# EAGLE board Led_Beleuchtung (EAGLE 7.3.0), part 1 of 2
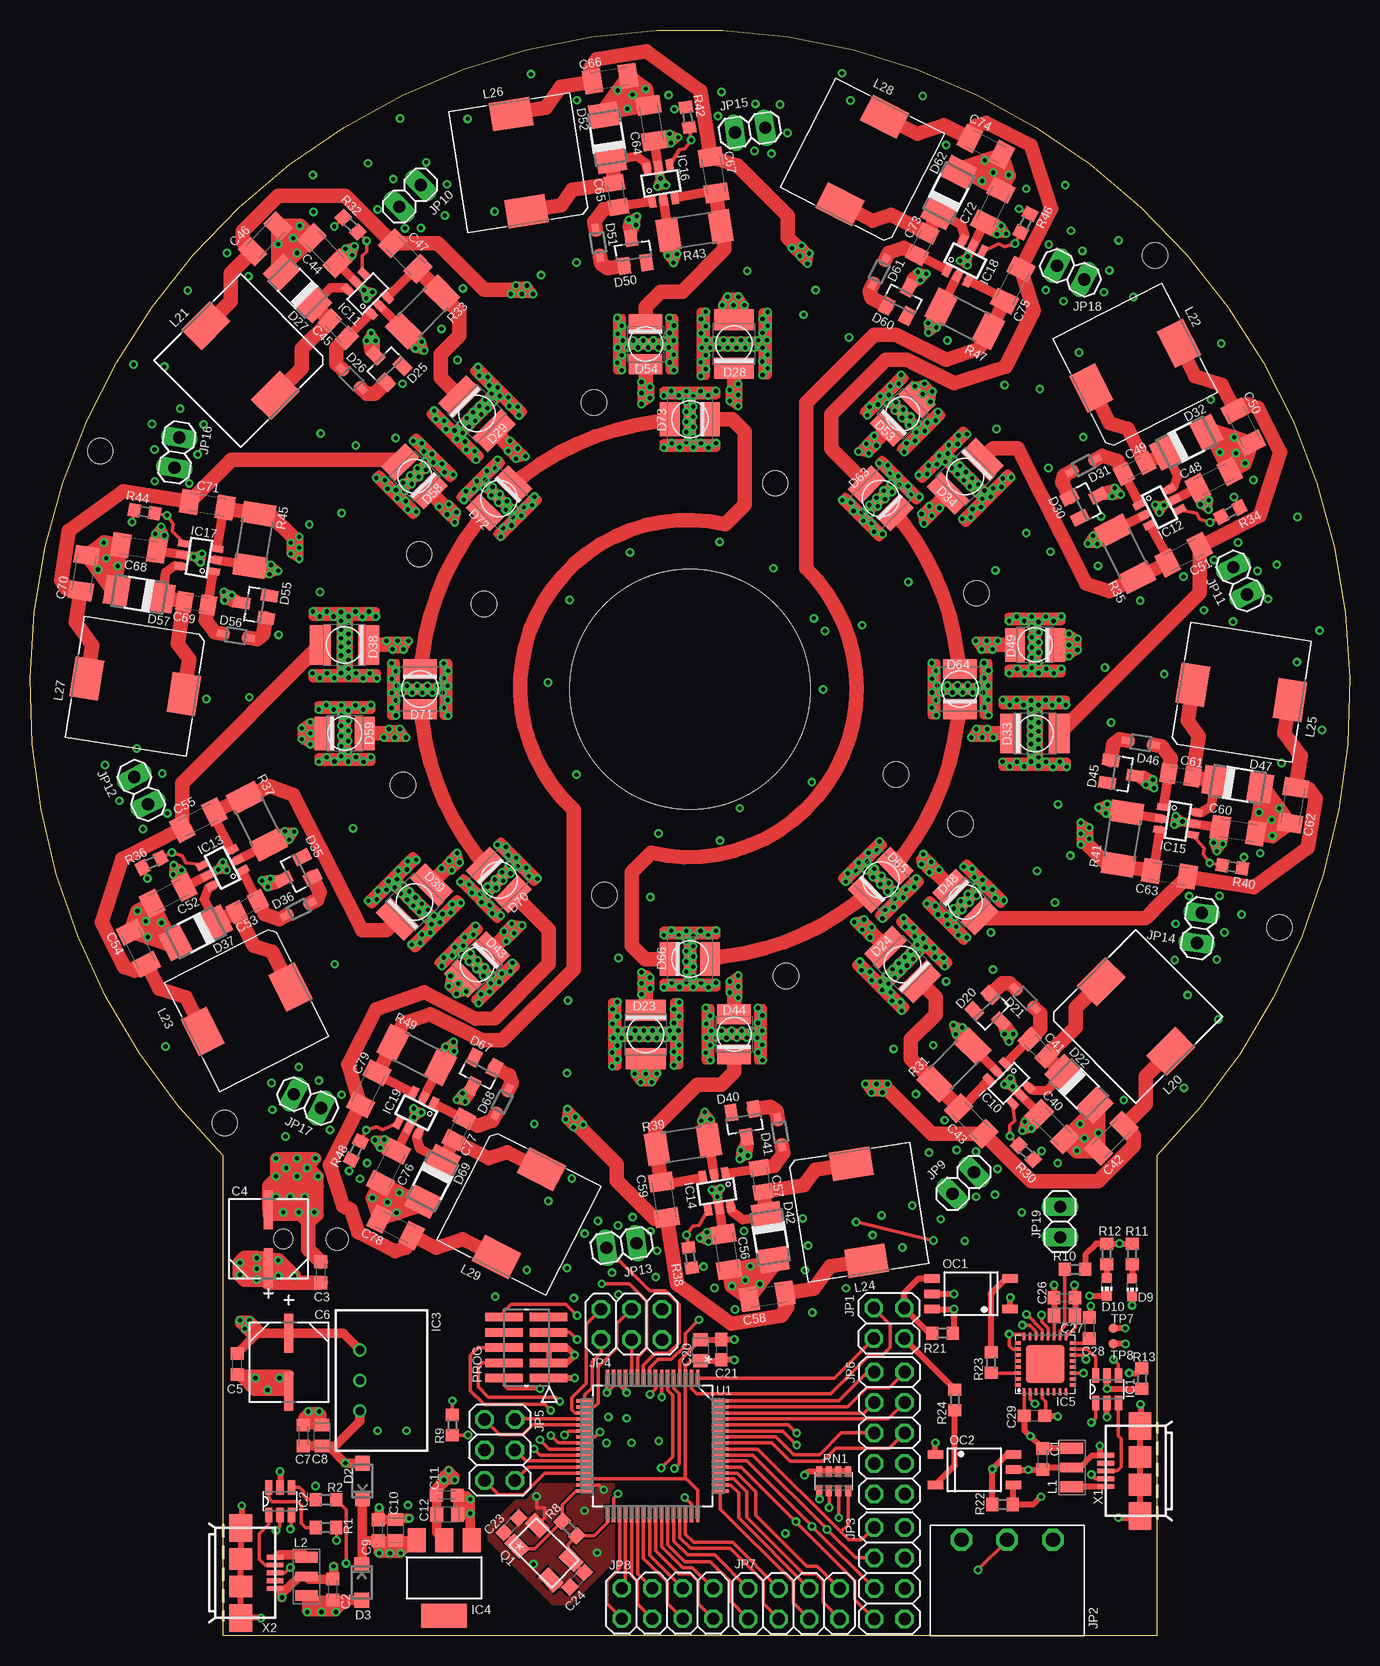
[diagram p3: board, top side]
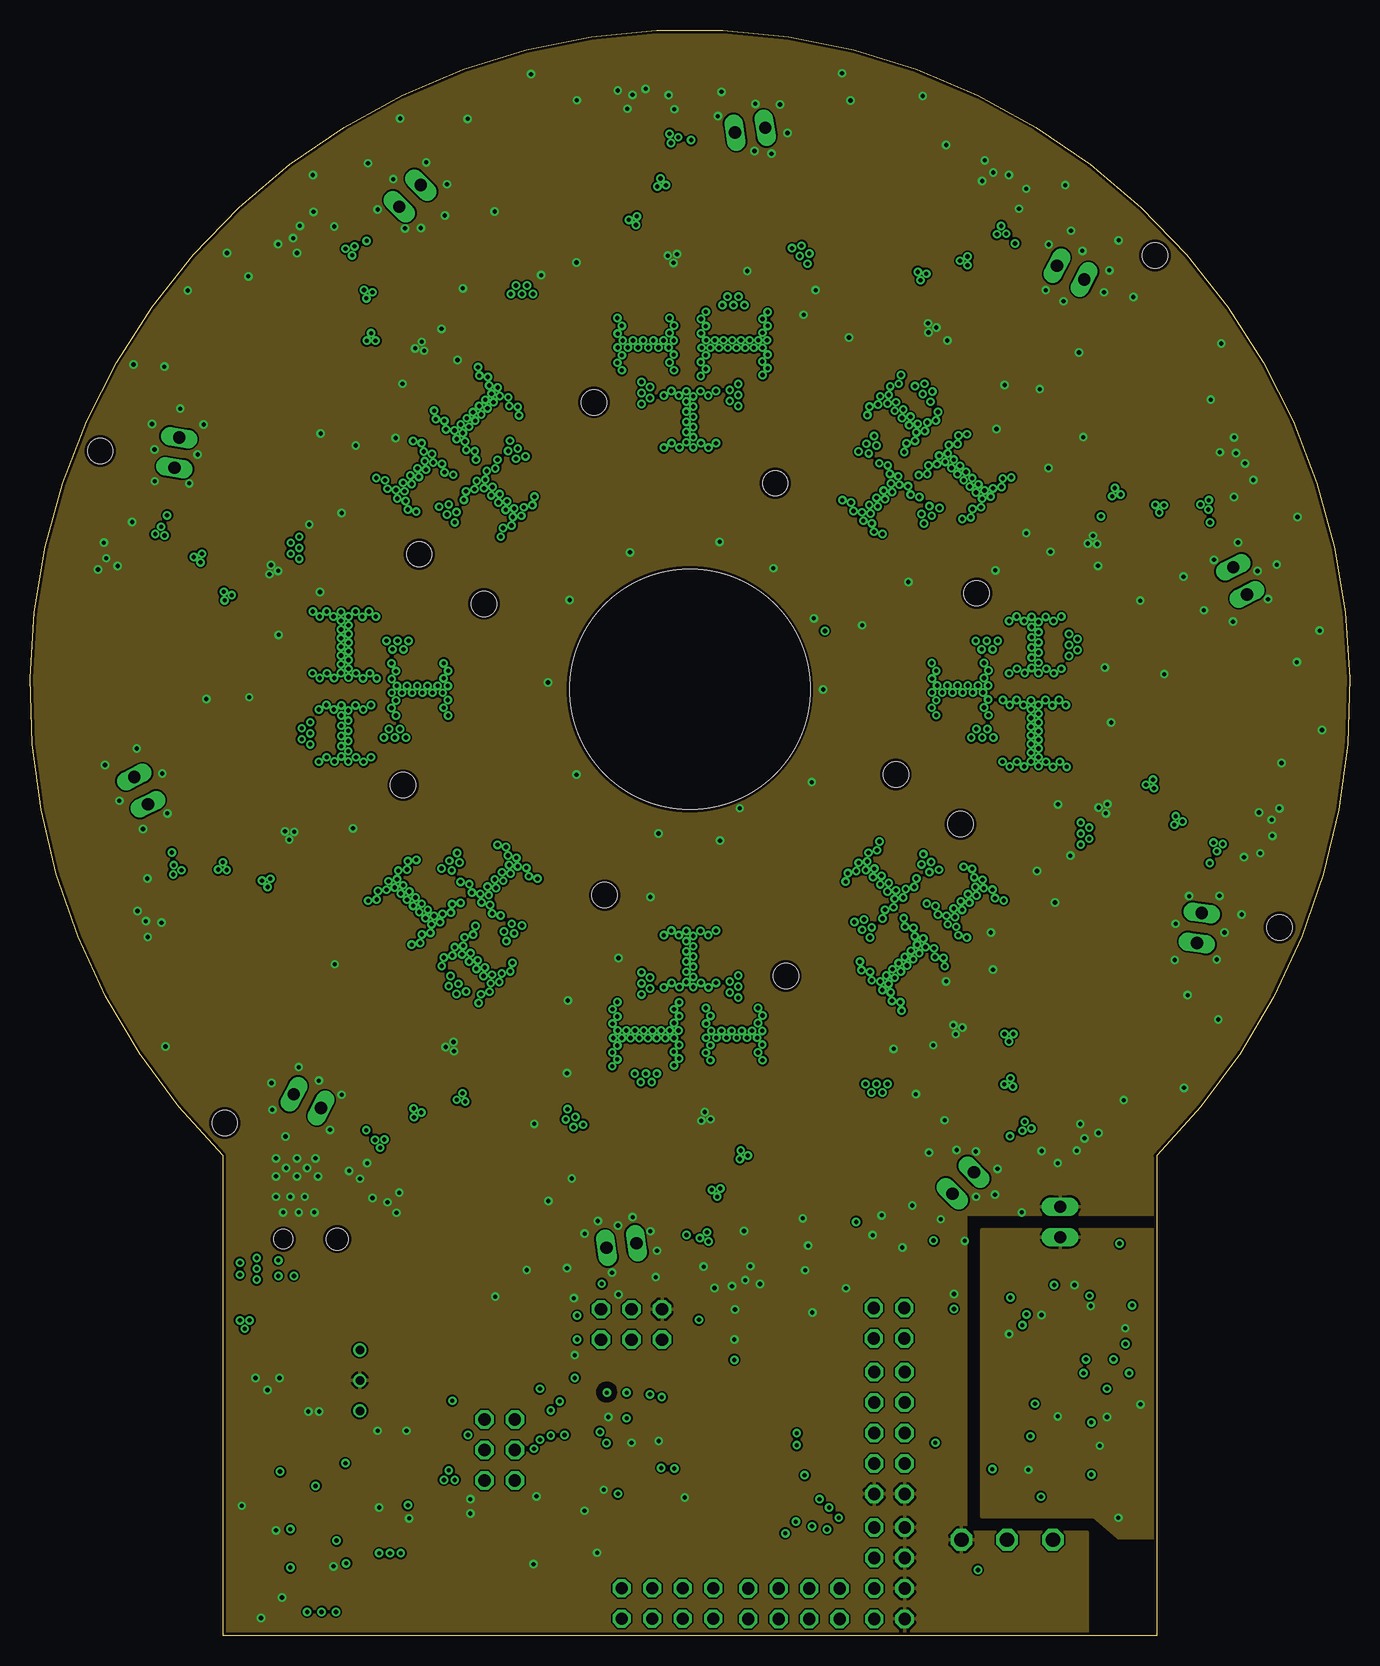
[diagram p4: board, inner layer Route2]
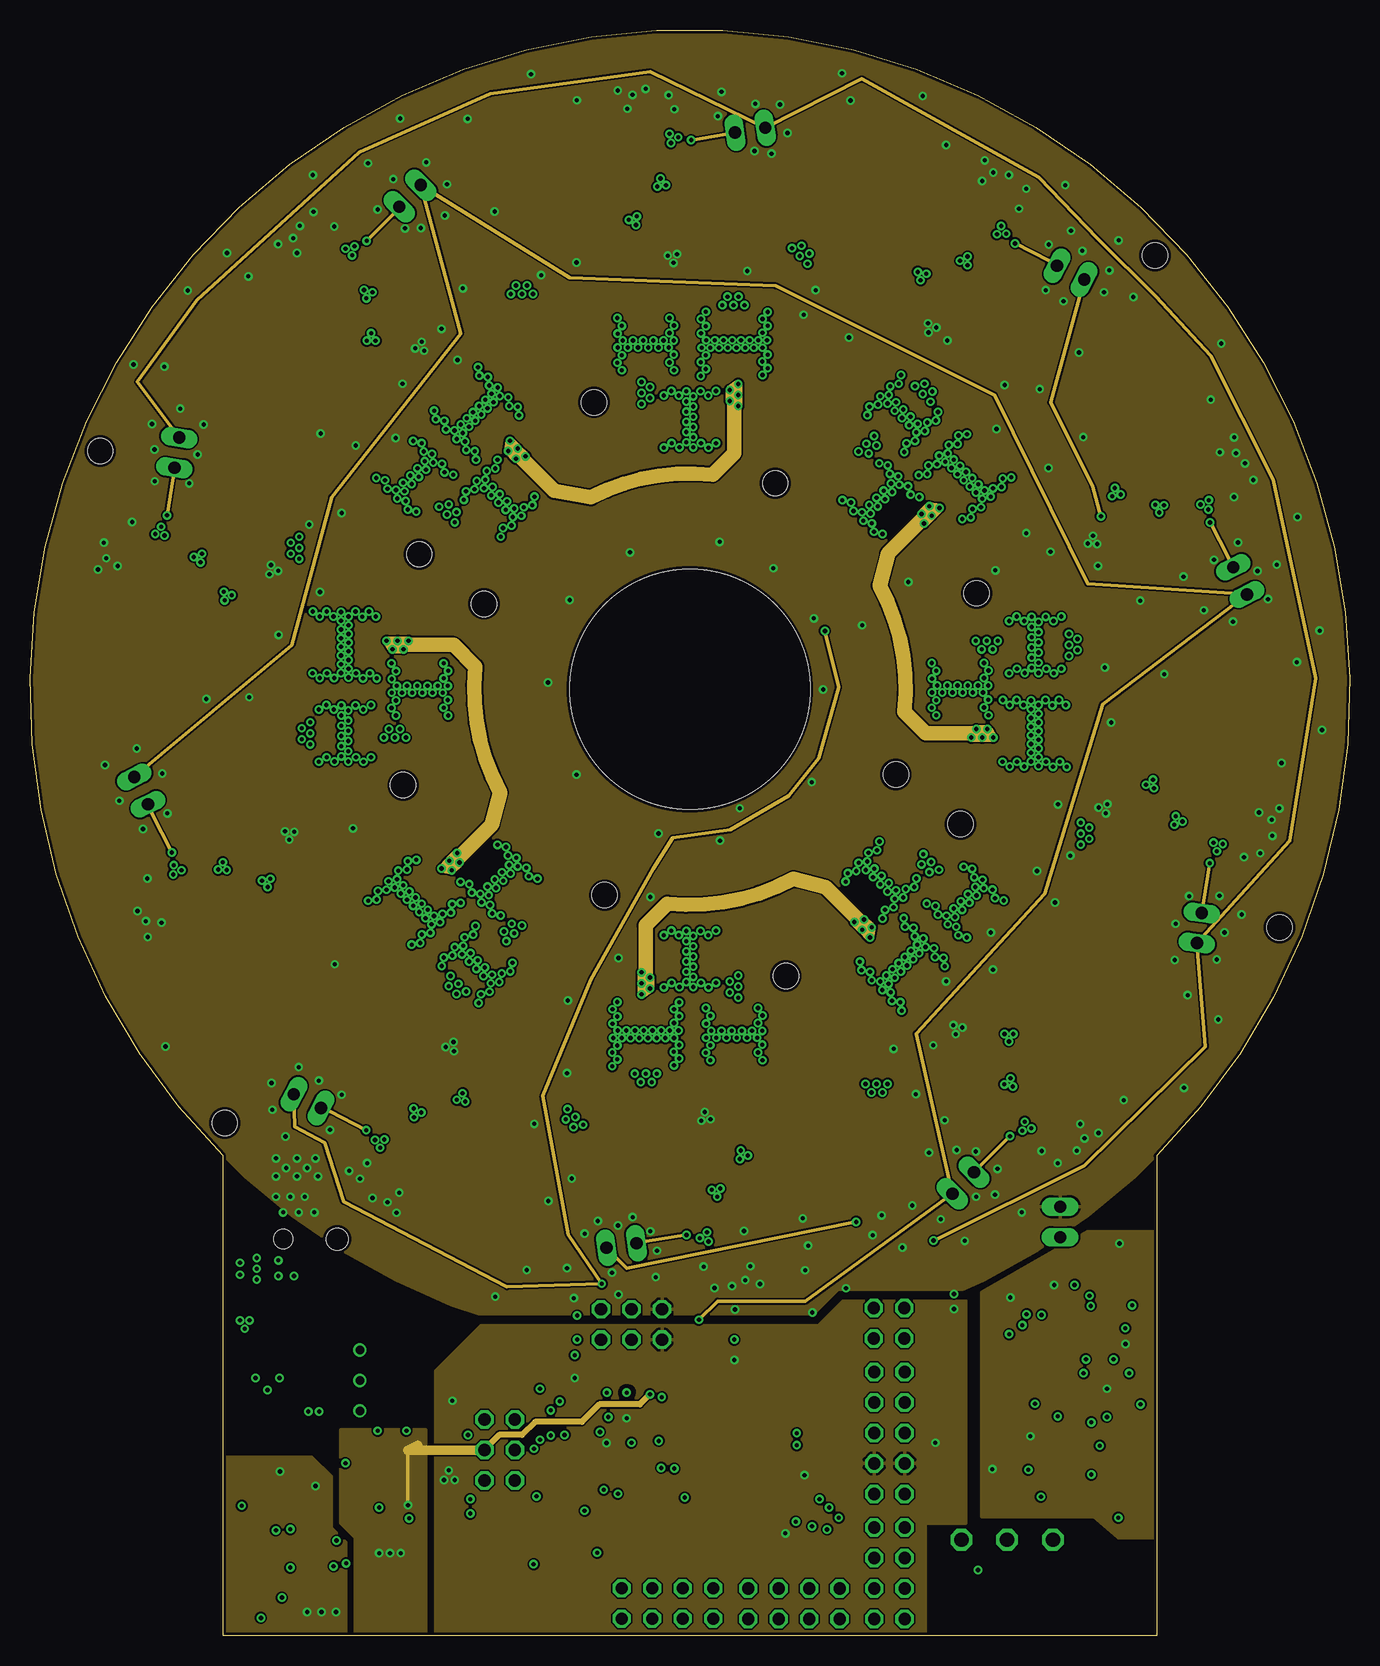
[diagram p5: board, inner layer Route3]
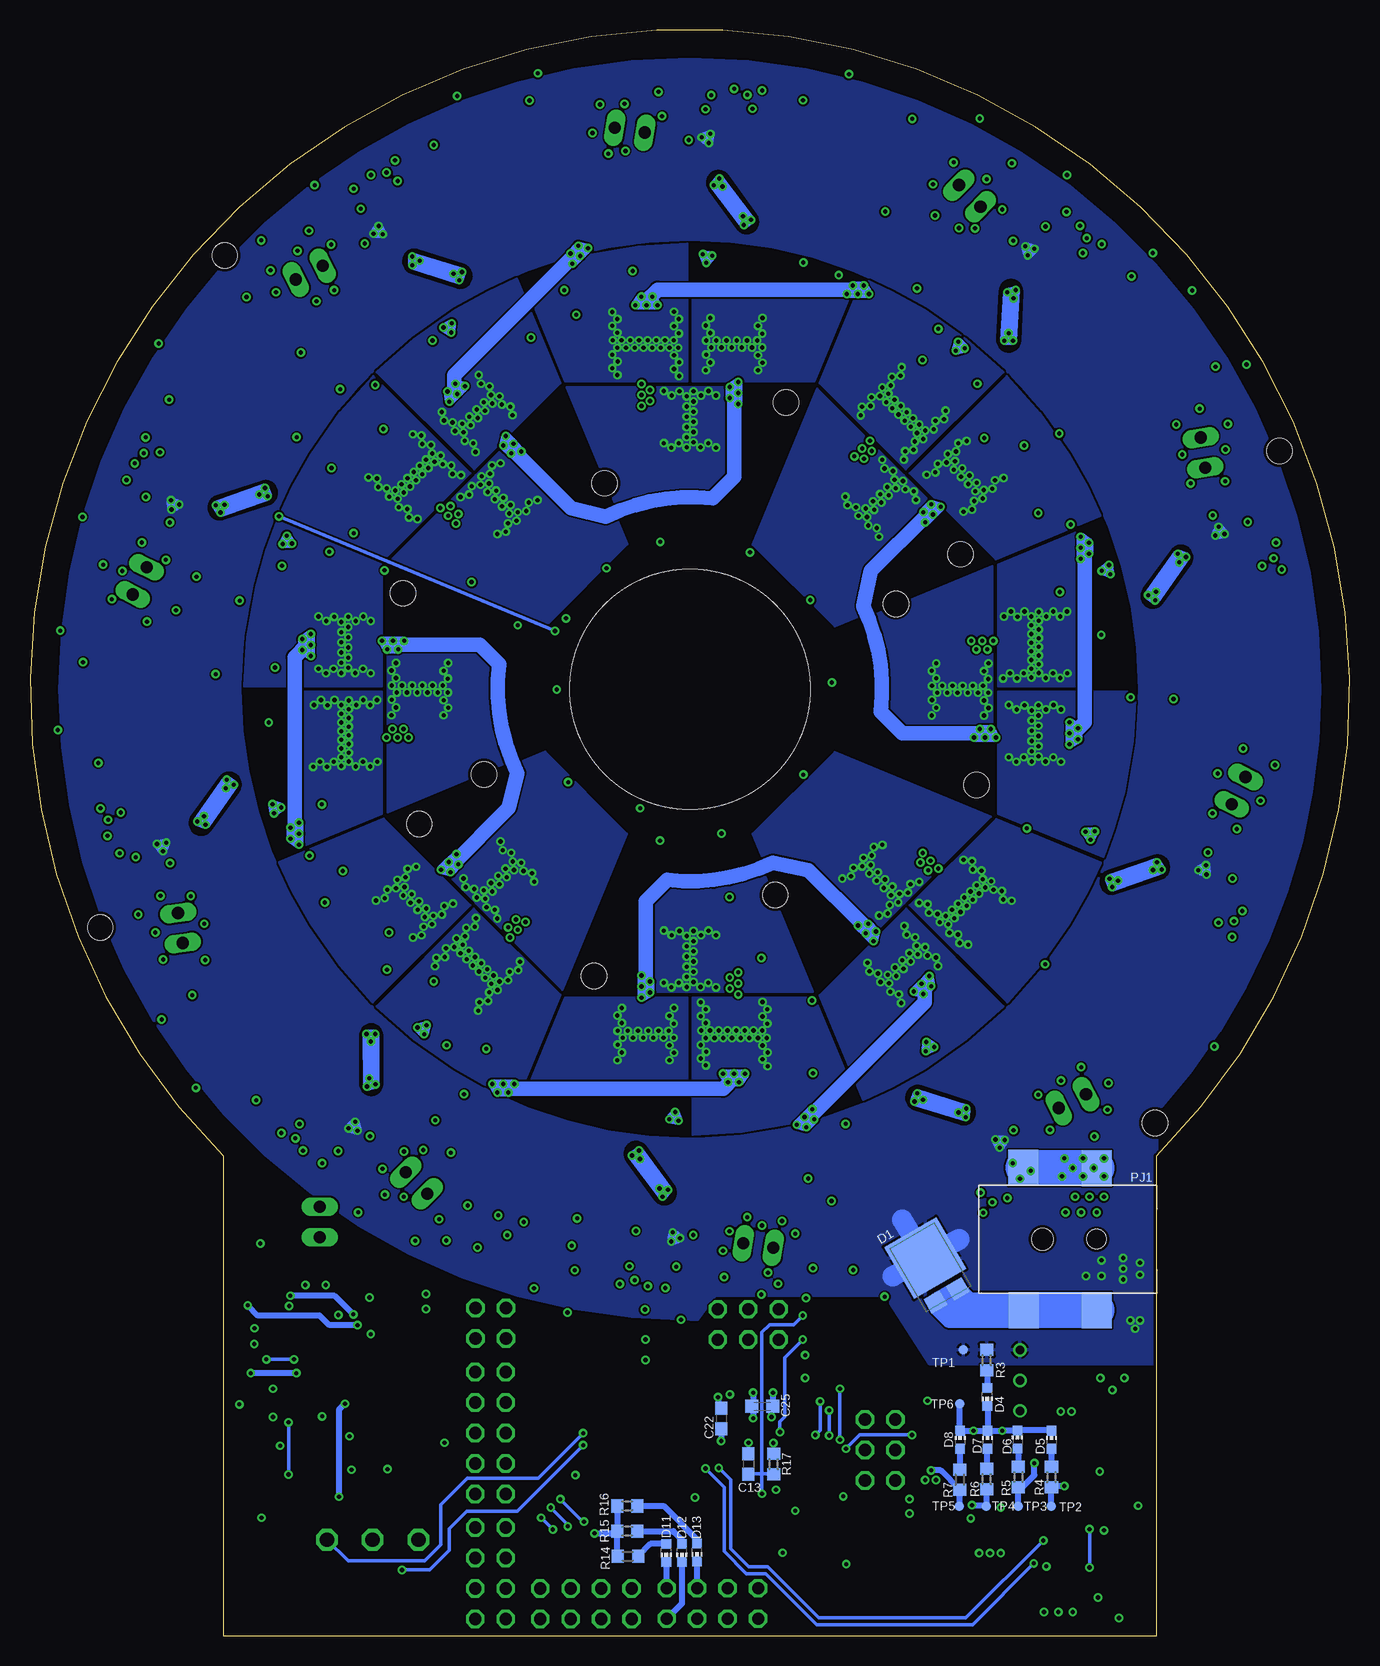
[diagram p6: board, bottom side, seen from below]

Size 109.98 x 133.82 mm. Coordinates in mm from the lower left corner, seen from the top.
Outline: 16.1,0 16.1,39.99 arc-270 93.88,39.99 93.88,0 16.1,0
Copper layers (1+2*3+16): Top 0.018mm / dielectric 0.36mm / Route2 0.035mm / dielectric 0.71mm / Route3 0.035mm / dielectric 0.36mm / Bottom 0.018mm
Design rules "eC_4Layer_PClass6_BaseCopperO18-I35_eCDefault *": minimum track width 0.15mm, minimum drill 0.35mm, track to track 0.15mm, track to pad 0.15mm, pad to pad 0.15mm, via to via 0.15mm, smd to smd 0mil, copper to edge 0.25mm, drill to drill 0.35mm, minimum pad ring 0.175mm, minimum via ring 0.125mm, stop-mask expansion 0mil, vias tented up to drill 0.45mm, thermal gap 0.2mm
Holes 2.1 mm at 62.1,96.05 37.83,85.99 47.88,61.72 72.15,71.78 32.44,90.13 47,102.78 78.89,86.88 77.54,67.64 62.99,54.99 31.09,70.89 5.85,98.74 93.75,115.03 104.13,59.03 16.23,42.74
Holes 20 mm at 54.99,78.88

## Footprints (pad centres in the part's own frame; a part is rotated, then mirrored left to right if it is on the bottom)
C0603K = smd 1.05 x 1.08: 1 -0.875,0; 2 0.875,0
CAPAE660X800N = smd 3.251 x 0.762: 1 -2.413,0; 2 2.413,0
CAPAE660X610N = smd 3.251 x 0.762: 1 -2.413,0; 2 2.413,0
SMC_P = smd 1.05 x 1.2: + -0.875,0; - 0.875,0
C0603 = smd 1.1 x 1: 1 -0.85,0; 2 0.85,0
C1206K = smd 1.5 x 2: 1 -1.5,0; 2 1.5,0
C0805K = smd 1.3 x 1.6: 1 -1,0; 2 1,0
TO-277A = smd 1.5 x 1.4: A1 1.065,-2.705; A2 -1.065,-2.705 | smd 5 x 5: C 0,0.895
SOD-123 = smd 1.25 x 1.22: A 1.475,0; C -1.475,0
CHIP-LED0603 = smd 0.8 x 0.8: A 0,-0.75; C 0,0.75
SOT23 = smd 1 x 1.4: 1 -0.95,-1.1; 2 0.95,-1.1; 3 0,1.1
SOD323 = smd 1 x 0.6: A 1.1,0; C -1.1,0
DO-214AC = smd 2 x 2.4: A 1.9,0; C -1.9,0
LTPL-C034UVH = smd 3.3 x 1.75: A 0,2.025; C 0,-2.025 | smd 1.27 x 0.635: TH 0,0
GW_CSSRM2.PM = smd 2.8 x 1.65: A 0,1.675; C 0,-1.675 | smd 1.27 x 0.635: TH 0,0
SFH_4715 = smd 2.8 x 1.65: A 0,1.675; C 0,-1.675 | smd 1.27 x 0.635: TH 0,0
SOT-23-6L = smd 0.6 x 1.2: 1 -0.95,-1.15; 2 0,-1.15; 3 0.95,-1.15; 4 0.95,1.15; 5 0,1.15; 6 -0.95,1.15
TSR-1 = drill 0.7 pad 1.1: 1 -2.54,0; 2 0,0; 3 2.54,0
SOT223 = smd 1.5 x 2: 1 -2.3,-3.15; 2 0,-3.15; 3 2.3,-3.15 | smd 3.8 x 2: 4 0,3.15
QFN32 = smd 0.6 x 0.3: 1 -2.3,1.75; 2 -2.3,1.25; 3 -2.3,0.75; 4 -2.3,0.25; 5 -2.3,-0.25; 6 -2.3,-0.75; 7 -2.3,-1.25; 8 -2.3,-1.75; 17 2.3,-1.75; 18 2.3,-1.25; 19 2.3,-0.75; 20 2.3,-0.25; 21 2.3,0.25; 22 2.3,0.75; 23 2.3,1.25; 24 2.3,1.75 | smd 0.3 x 0.6: 9 -1.75,-2.3; 10 -1.25,-2.3; 11 -0.75,-2.3; 12 -0.25,-2.3; 13 0.25,-2.3; 14 0.75,-2.3; 15 1.25,-2.3; 16 1.75,-2.3; 25 1.75,2.3; 26 1.25,2.3; 27 0.75,2.3; 28 0.25,2.3; 29 -0.25,2.3; 30 -0.75,2.3; 31 -1.25,2.3; 32 -1.75,2.3 | smd 3.2 x 3.2: EXP 0,0
DDC6_SOT = smd 0.6 x 1.1: 1 -0.95,-1.35; 2 0,-1.35; 3 0.95,-1.35; 4 0.95,1.35; 5 0,1.35; 6 -0.95,1.35
2X02 = drill 1.016 octagon: 1 -1.27,-1.27; 2 -1.27,1.27; 3 1.27,-1.27; 4 1.27,1.27
BCH-381H-3GN = drill 1.2 octagon: 1 3.81,8; 2 0,8; 3 -3.81,8
2X04 = drill 1.016 octagon: 1 -3.81,-1.27; 2 -3.81,1.27; 3 -1.27,-1.27; 4 -1.27,1.27; 5 1.27,-1.27; 6 1.27,1.27; 7 3.81,-1.27; 8 3.81,1.27
2X03 = drill 1.016 octagon: 1 -2.54,-1.27; 2 -2.54,1.27; 3 0,-1.27; 4 0,1.27; 5 2.54,-1.27; 6 2.54,1.27
2X05 = drill 1.016 octagon: 1 -5.08,-1.27; 2 -5.08,1.27; 3 -2.54,-1.27; 4 -2.54,1.27; 5 0,-1.27; 6 0,1.27; 7 2.54,-1.27; 8 2.54,1.27; 9 5.08,-1.27; 10 5.08,1.27
1X02 = drill 1.016 long: 1 -1.27,0; 2 1.27,0
EMIFILTER = smd 0.9 x 1.9: 1 -1.6,0; 3 1.6,0 | smd 0.8 x 1.9: 2 0,0
WE-PDF = smd 3.4 x 2.4: 1 0,4.1; 2 0,-4.1
PC400 = smd 0.7 x 1.3: 1 -1.27,-3.25; 3 1.27,-3.25; 4 1.27,3.25; 5 0,3.25; 6 -1.27,3.25
PJ-002AH-SMT-TR = smd 2.5 x 3: 1.1 5,5.915; 1.2 11.05,5.915; 2 5,-5.915; 3 11.1,-5.965 | hole 1.6: 5,0 | hole 1.8: 9.5,0
SAMTEC_FTS105-01-L-DV = smd 0.711 x 3.124: 1 -2.54,-1.854; 2 -2.54,1.854; 3 -1.27,-1.854; 4 -1.27,1.854; 5 0,-1.854; 6 0,1.854; 7 1.27,-1.854; 8 1.27,1.854; 9 2.54,-1.854; 10 2.54,1.854
ABM3B = smd 1.8 x 1.2: 1 -2,-1.2; 3 2,1.2; GND1 -2,1.2; GND2 2,-1.2
R0603 = smd 1 x 1.1: 1 -0.85,0; 2 0.85,0
R2010 = smd 1.8 x 2.7: 1 -2.2,0; 2 2.2,0
CTS742C083 = smd 0.5 x 0.9: 1 -1.2,-0.8; 2 -0.4,-0.8; 3 0.4,-0.8; 4 1.2,-0.8; 5 1.2,0.8; 6 0.4,0.8; 7 -0.4,0.8; 8 -1.2,0.8
TP08R = smd 0.8 x 0.8: TP 0,0
QFP50P1200X1200X160-64N = smd 1.422 x 0.279: 1 -5.639,3.759; 2 -5.639,3.251; 3 -5.639,2.743; 4 -5.639,2.261; 5 -5.639,1.753; 6 -5.639,1.245; 7 -5.639,0.762; 8 -5.639,0.254; 9 -5.639,-0.254; 10 -5.639,-0.762; 11 -5.639,-1.245; 12 -5.639,-1.753; 13 -5.639,-2.261; 14 -5.639,-2.743; 15 -5.639,-3.251; 16 -5.639,-3.759; 33 5.639,-3.759; 34 5.639,-3.251; 35 5.639,-2.743; 36 5.639,-2.261; 37 5.639,-1.753; 38 5.639,-1.245; 39 5.639,-0.762; 40 5.639,-0.254; 41 5.639,0.254; 42 5.639,0.762; 43 5.639,1.245; 44 5.639,1.753; 45 5.639,2.261; 46 5.639,2.743; 47 5.639,3.251; 48 5.639,3.759 | smd 0.279 x 1.422: 17 -3.759,-5.639; 18 -3.251,-5.639; 19 -2.743,-5.639; 20 -2.261,-5.639; 21 -1.753,-5.639; 22 -1.245,-5.639; 23 -0.762,-5.639; 24 -0.254,-5.639; 25 0.254,-5.639; 26 0.762,-5.639; 27 1.245,-5.639; 28 1.753,-5.639; 29 2.261,-5.639; 30 2.743,-5.639; 31 3.251,-5.639; 32 3.759,-5.639; 49 3.759,5.639; 50 3.251,5.639; 51 2.743,5.639; 52 2.261,5.639; 53 1.753,5.639; 54 1.245,5.639; 55 0.762,5.639; 56 0.254,5.639; 57 -0.254,5.639; 58 -0.762,5.639; 59 -1.245,5.639; 60 -1.753,5.639; 61 -2.261,5.639; 62 -2.743,5.639; 63 -3.251,5.639; 64 -3.759,5.639
MICRO-USB = smd 0.4 x 1.4: 1 -1.3,2.85; 2 -0.65,2.85; 3 0,2.85; 4 0.65,2.85; 5 1.3,2.85 | smd 2.3 x 1.9: GND1 -3.75,0; GND2 3.75,0 | smd 1.8 x 1.9: GND3 -1.15,0; GND4 1.15,0

## Placement (x,y rotation side)
C1  100nF  [C0603K]  84.38,14.73 90 top
C2  100nF  [C0603K]  25.23,3.85 270 top
C3  100nF  [C0603K]  24.23,30.29 270 top
C4  100UF  [CAPAE660X800N]  19.87,33.09 90 top
C5  100nF  [C0603K]  17.26,22.66 90 top
C6  22uF  [CAPAE660X610N]  21.58,22.79 270 top
C7  100nF  [C0603K]  22.78,16.68 270 top
C8  10uF  [SMC_P]  24.33,16.7 90 top
C9  100nF  [C0603K]  29.01,8.79 270 top
C10  10uF  [SMC_P]  30.46,8.8 90 top
C11  100nF  [C0603K]  34.73,11.72 180 top
C12  10uF  [SMC_P]  34.77,10.1 0 top
C13  100nF  [C0603]  50.12,14.31 270 bottom
C20  10uF  [SMC_P]  55.89,23.8 90 top
C21  100nF  [C0603]  57.61,23.85 270 top
C22  2.2uF  [C0603]  52.39,18.1 270 bottom
C23  22pF  [C0603]  40.1,9.21 45 top
C24  22pF  [C0603]  45.6,4.67 225 top
C25  100nF  [C0603K]  48.96,19.12 180 bottom
C26  100nF  [C0603K]  86.21,28.17 180 top
C27  4.7uF  [SMC_P]  86.22,26.7 0 top
C28  100nF  [C0603K]  88.28,25.66 270 top
C29  100nF  [C0603]  83.71,18.32 180 top
C40  10uF  [C1206K]  85.16,42.45 135 top
C41  0.01uF  [C0805K]  83.99,49 315 top
C42  1uF  [C1206K]  90.1,41.46 45 top
C43  1uF  [C1206K]  78.43,42.89 135 top
C44  10uF  [C1206K]  24.55,115.43 315 top
C45  0.01uF  [C0805K]  25.72,108.88 135 top
C46  1uF  [C1206K]  19.61,116.42 225 top
C47  1uF  [C1206K]  31.28,114.99 315 top
C48  10uF  [C1206K]  98.65,96.36 207 top
C49  0.01uF  [C0805K]  92.05,97.27 27 top
C50  1uF  [C1206K]  101.11,100.75 117 top
C51  1uF  [C1206K]  96.14,90.09 207 top
C52  10uF  [C1206K]  11.51,61.7 27 top
C53  0.01uF  [C0805K]  18.1,60.79 207 top
C54  1uF  [C1206K]  9.04,57.31 297 top
C55  1uF  [C1206K]  14.02,67.97 27 top
C56  10uF  [C1206K]  58.02,32 99 top
C57  0.01uF  [C0805K]  60.93,37.99 279 top
C58  1uF  [C1206K]  61.44,28.3 9 top
C59  1uF  [C1206K]  52.84,36.32 99 top
C60  10uF  [C1206K]  100.67,67.1 171 top
C61  0.01uF  [C0805K]  95.87,71.71 351 top
C62  1uF  [C1206K]  105.24,69.2 81 top
C63  1uF  [C1206K]  94.96,63.5 171 top
C64  10uF  [C1206K]  51.78,126.05 279 top
C65  0.01uF  [C0805K]  48.88,120.06 99 top
C66  1uF  [C1206K]  48.37,129.76 189 top
C67  1uF  [C1206K]  56.97,121.73 279 top
C68  10uF  [C1206K]  9.06,90.66 351 top
C69  0.01uF  [C0805K]  13.86,86.04 171 top
C70  1uF  [C1206K]  4.49,88.56 261 top
C71  1uF  [C1206K]  14.78,94.25 351 top
C72  10uF  [C1206K]  80.24,119.11 243 top
C73  0.01uF  [C0805K]  74.37,115.97 63 top
C74  1uF  [C1206K]  79.65,124.11 153 top
C75  1uF  [C1206K]  81.89,112.56 243 top
C76  10uF  [C1206K]  29.87,39.06 63 top
C77  0.01uF  [C0805K]  35.75,42.19 243 top
C78  1uF  [C1206K]  30.46,34.05 333 top
C79  1uF  [C1206K]  28.22,45.6 63 top
D1  AS3PM  [TO-277A]  34.95,30.71 30 bottom
D2  MBR120VLSFT1  [SOD-123]  27.7,12.91 90 top
D3  MBR120VLSFT1  [SOD-123]  27.65,4.43 270 top
D4  gn  [CHIP-LED0603]  30.21,19.91 180 bottom
D5  gn  [CHIP-LED0603]  24.86,16.34 0 bottom
D6  gn  [CHIP-LED0603]  27.7,16.36 0 bottom
D7  gn  [CHIP-LED0603]  30.19,16.34 0 bottom
D8  gn  [CHIP-LED0603]  32.47,16.34 0 bottom
D9  gn  [CHIP-LED0603]  91.85,29.02 180 top
D10  yw  [CHIP-LED0603]  89.73,29.07 180 top
D11  gn  [CHIP-LED0603]  56.97,6.9 180 bottom
D12  rd  [CHIP-LED0603]  55.67,6.9 180 bottom
D13  yw  [CHIP-LED0603]  54.4,6.94 180 bottom
D20  8V2  [SOT23]  80.13,51.96 225 top
D21  CMDSH-3  [SOD323]  82.92,53.13 135 top
D22  SS13  [DO-214AC]  87.41,45.59 315 top
D23  LTPL-C034UVH  [LTPL-C034UVH]  51.31,50.12 180 top
D24  LTPL-C034UVH  [LTPL-C034UVH]  72.72,55.94 45 top
D25  8V2  [SOT23]  29.58,105.92 45 top
D26  CMDSH-3  [SOD323]  26.79,104.75 315 top
D27  SS13  [DO-214AC]  22.3,112.29 135 top
D28  LTPL-C034UVH  [LTPL-C034UVH]  58.67,107.65 0 top
D29  LTPL-C034UVH  [LTPL-C034UVH]  37.25,101.84 225 top
D30  8V2  [SOT23]  88.04,94.52 297 top
D31  CMDSH-3  [SOD323]  87.79,97.52 207 top
D32  SS13  [DO-214AC]  96.35,99.46 27 top
D33  LTPL-C034UVH  [LTPL-C034UVH]  83.75,75.2 270 top
D34  LTPL-C034UVH  [LTPL-C034UVH]  77.94,96.63 135 top
D35  8V2  [SOT23]  22.12,63.54 117 top
D36  CMDSH-3  [SOD323]  22.37,60.53 27 top
D37  SS13  [DO-214AC]  13.8,58.59 207 top
D38  LTPL-C034UVH  [LTPL-C034UVH]  26.22,82.58 90 top
D39  LTPL-C034UVH  [LTPL-C034UVH]  32.04,61.16 315 top
D40  8V2  [SOT23]  59.55,42.65 189 top
D41  CMDSH-3  [SOD323]  62.49,41.96 99 top
D42  SS13  [DO-214AC]  61.69,33.22 279 top
D43  GW_CSSRM2.PM  [GW_CSSRM2.PM]  37.26,55.94 135 top
D44  GW_CSSRM2.PM  [GW_CSSRM2.PM]  58.68,50.12 0 top
D45  8V2  [SOT23]  91,71.84 261 top
D46  CMDSH-3  [SOD323]  92.57,74.42 171 top
D47  SS13  [DO-214AC]  100.64,70.96 351 top
D48  GW_CSSRM2.PM  [GW_CSSRM2.PM]  77.94,61.15 225 top
D49  GW_CSSRM2.PM  [GW_CSSRM2.PM]  83.75,82.58 90 top
D50  8V2  [SOT23]  50.26,115.4 9 top
D51  CMDSH-3  [SOD323]  47.32,116.09 279 top
D52  SS13  [DO-214AC]  48.12,124.83 99 top
D53  GW_CSSRM2.PM  [GW_CSSRM2.PM]  72.72,101.84 315 top
D54  GW_CSSRM2.PM  [GW_CSSRM2.PM]  51.31,107.65 180 top
D55  8V2  [SOT23]  18.73,85.91 81 top
D56  CMDSH-3  [SOD323]  17.16,83.33 351 top
D57  SS13  [DO-214AC]  9.09,86.8 171 top
D58  GW_CSSRM2.PM  [GW_CSSRM2.PM]  32.05,96.62 45 top
D59  GW_CSSRM2.PM  [GW_CSSRM2.PM]  26.22,75.2 270 top
D60  8V2  [SOT23]  72.74,111.38 333 top
D61  CMDSH-3  [SOD323]  70.77,113.67 243 top
D62  SS13  [DO-214AC]  76.56,120.27 63 top
D63  SFH_4715  [SFH_4715]  70.9,94.79 45 top
D64  SFH_4715  [SFH_4715]  77.49,78.9 0 top
D65  SFH_4715  [SFH_4715]  70.9,62.98 315 top
D66  SFH_4715  [SFH_4715]  54.99,56.39 270 top
D67  8V2  [SOT23]  37.37,46.78 153 top
D68  CMDSH-3  [SOD323]  39.34,44.49 63 top
D69  SS13  [DO-214AC]  33.56,37.89 243 top
D70  SFH_4715  [SFH_4715]  39.08,62.98 225 top
D71  SFH_4715  [SFH_4715]  32.49,78.88 180 top
D72  SFH_4715  [SFH_4715]  39.08,94.79 135 top
D73  SFH_4715  [SFH_4715]  54.99,101.38 90 top
IC1  USBLC6-2  [SOT-23-6L]  89.75,20.55 0 top
IC2  USBLC6-2  [SOT-23-6L]  20.84,11.21 0 top
IC3  TSR-12450  [TSR-1]  27.49,21.28 270 top
IC4  NCP1117ST33T3G  [SOT223]  34.51,4.83 180 top
IC5  FT232RQ  [QFN32]  84.6,22.64 90 top
IC10  LM3405A  [DDC6_SOT]  81.57,46.04 225 top
IC11  LM3405A  [DDC6_SOT]  28.14,111.84 45 top
IC12  LM3405A  [DDC6_SOT]  94.12,94.05 297 top
IC13  LM3405A  [DDC6_SOT]  16.04,64.01 117 top
IC14  LM3405A  [DDC6_SOT]  57.23,37.02 189 top
IC15  LM3405A  [DDC6_SOT]  95.65,67.89 261 top
IC16  LM3405A  [DDC6_SOT]  52.58,121.04 9 top
IC17  LM3405A  [DDC6_SOT]  14.08,89.86 81 top
IC18  LM3405A  [DDC6_SOT]  77.93,114.58 333 top
IC19  LM3405A  [DDC6_SOT]  32.18,43.58 153 top
JP1  [2X02]  71.59,26.04 90 top
JP2  [BCH-381H-3GN]  81.43,0 0 top
JP3  [2X04]  71.62,5.22 270 top
JP4  [2X03]  50.13,25.95 180 top
JP5  [2X03]  39.14,15.48 270 top
JP6  [2X05]  71.62,16.9 270 top
JP7  [2X04]  63.66,2.67 180 top
JP8  [2X04]  53.12,2.69 180 top
JP9  [1X02]  77.77,37.74 45 top
JP10  [1X02]  31.68,119.99 225 top
JP11  [1X02]  100.84,87.91 117 top
JP12  [1X02]  9.26,70.43 297 top
JP13  [1X02]  49.29,32.52 9 top
JP14  [1X02]  97.45,58.98 81 top
JP15  [1X02]  60.01,125.47 189 top
JP16  [1X02]  12.23,98.6 261 top
JP17  [1X02]  23.12,44.55 333 top
JP18  [1X02]  86.71,113.6 153 top
JP19  [1X02]  85.84,34.48 270 top
L1  NFE31  [EMIFILTER]  86.82,14.02 90 top
L2  NFE31  [EMIFILTER]  23.05,4.95 270 top
L20  22uH  [WE-PDF]  92.17,51.61 45 top
L21  22uH  [WE-PDF]  17.54,106.27 225 top
L22  22uH  [WE-PDF]  92.1,105.85 117 top
L23  22uH  [WE-PDF]  18.06,52.21 297 top
L24  13uH  [WE-PDF]  69.07,35.29 9 top
L25  13uH  [WE-PDF]  100.95,78.62 81 top
L26  13uH  [WE-PDF]  40.73,122.76 189 top
L27  13uH  [WE-PDF]  8.78,79.13 261 top
L28  11uH  [WE-PDF]  69.36,122.94 153 top
L29  11uH  [WE-PDF]  40.75,35.22 333 top
OC1  PC400  [PC400]  78.42,28.5 90 top
OC2  PC400  [PC400]  78.7,13.84 270 top
PJ1  PJ-002AH-SMT-TR  [PJ-002AH-SMT-TR]  16.1,33.06 180 bottom
PROG  FTS105-01-L-DV  [SAMTEC_FTS105-01-L-DV]  41.36,24.01 90 top
Q1  ABM3B4PIN  [ABM3B]  42.84,6.92 315 top
R1  33R  [R0603]  24.65,9.02 0 top
R2  33R  [R0603]  24.65,11.34 0 top
R3  8k2  [R0603]  30.26,22.97 90 bottom
R4  1k5  [R0603]  24.87,13.22 270 bottom
R5  1k5  [R0603]  27.63,13.23 270 bottom
R6  1k5  [R0603]  30.27,13.05 270 bottom
R7  620R  [R0603]  32.5,13 270 bottom
R8  1M  [R0603]  44.96,8.95 135 top
R9  10k  [R0603]  35.19,17.55 270 top
R10  10k  [R0603]  87.09,30.53 0 top
R11  1k8  [R0603]  91.85,31.83 270 top
R12  2k2  [R0603]  89.73,31.83 90 top
R13  10k  [R0603]  92.65,21.43 270 top
R14  620R  [R0603]  60.17,6.62 180 bottom
R15  1k  [R0603]  60.22,8.72 180 bottom
R16  1k  [R0603]  60.22,10.82 180 bottom
R17  10k  [R0603]  48.02,14.31 270 bottom
R21  4k7  [R0603]  76.03,25.22 180 top
R22  4k7  [R0603]  81.04,10.94 0 top
R23  1k  [R0603]  80.1,22.77 270 top
R24  1k  [R0603]  77.07,19.66 270 top
R30  39k  [R0603]  83.01,40.29 135 top
R31  0R4  [R2010]  76.99,47.56 45 top
R32  39k  [R0603]  26.7,117.59 315 top
R33  0R4  [R2010]  32.72,110.32 225 top
R34  39k  [R0603]  100.03,93.64 207 top
R35  0R4  [R2010]  91.25,90.17 117 top
R36  39k  [R0603]  10.13,64.42 27 top
R37  0R4  [R2010]  18.9,67.89 297 top
R38  39k  [R0603]  55.01,31.52 99 top
R39  0R3  [R2010]  54.42,40.94 9 top
R40  39k  [R0603]  100.19,64.09 171 top
R41  0R3  [R2010]  91.05,66.43 81 top
R42  39k  [R0603]  54.79,126.53 279 top
R43  0R3  [R2010]  55.39,117.11 189 top
R44  39k  [R0603]  9.54,93.67 351 top
R45  0R3  [R2010]  18.68,91.32 261 top
R46  20k  [R0603]  82.96,117.72 243 top
R47  0R25  [R2010]  77.9,109.75 153 top
R48  20k  [R0603]  27.16,40.44 63 top
R49  0R25  [R2010]  32.22,48.41 333 top
RN1  10k  [CTS742C083]  66.97,12.9 0 top
TP1  +12V  [TP08R]  32.21,23.85 180 bottom
TP2  +5V_USB  [TP08R]  24.86,10.8 0 bottom
TP3  +5V_Reg  [TP08R]  27.64,10.8 0 bottom
TP4  +5V  [TP08R]  30.29,10.8 0 bottom
TP5  +3V3  [TP08R]  32.54,10.8 0 bottom
TP6  GND  [TP08R]  32.49,19.35 0 bottom
TP7  GND  [TP08R]  90.26,25.63 270 top
TP8  +5V  [TP08R]  90.28,24.32 90 top
U1  MKL26Z256VLH4  [QFP50P1200X1200X160-64N]  51.88,15.82 270 top
X1  MICRO_USB  [MICRO-USB]  92.5,13.74 90 top
X2  MICRO_USB  [MICRO-USB]  17.57,5.24 270 top

## Tracks (layer width: path | path; a pad name or v marks a point on that pad's centre or on a via)
3V3OUT_FT232
  Top 0.3: IC5.16 88.19,24.39 arc90 C28.2
+3V3  (via drill 0.35 pad 0.7)
  Top 0.3: U1.13 49.62,20.36 | U1.14 49.14,20.85 v49.72,20.26 | v35.19,19.58 R9.1 | U1.3 54.62,22.52 55.04,22.93 55.88,22.93 C20.+ | 54.64,21.44 U1.3 | U1.30 54.59,13.07 | 54.59,13.07 54.7,13.07 55.64,12.13 U1.48 | U1.3 54.62,13.11 54.59,13.07
  Top 0.305: 49.62,20.36 v49.72,20.26
  Top 0.5: 33.89,12.38 33.89,12.28 33.89,11.58 | RN1.5 RN1.6 RN1.7 RN1.8 64.86,13.7 v64.54,13.38 | PROG.1 v45.39,21.48 | OC2.1 v75.44,16.08 | OC1.6 v76.98,27.23 v76.99,27.23 76.99,25.34 R21.1 | C20.+ 57.54,22.92 C21.2 57.63,22.98 v58.69,22.98
  Top 0.8: IC4.2 33.9,8.59 C12.+ 33.9,11.68 C11.2 33.99,11.85 33.99,12.18 34.79,12.98 v35.39,12.98 35.39,13.28 v34.89,13.78 34.49,13.38 v34.49,12.98 33.89,12.38 | 33.89,12.28 34.99,13.38
  Bottom 0.3: 49.6,19.33 C25.2 | 49.72,19.03 C25.2 | 49.72,19.23 C25.2 | v48.04,16.06 48.04,15.18 R17.1
  Bottom 0.5: 49.72,19.03 v49.72,18.13 | v49.72,20.26 49.72,19.23 | TP5.TP 32.5,10.84 R7.2 32.5,12.19 34.09,13.78 v34.89,13.78 | R14.2 61.07,6.67 R15.2 | R15.2 R16.2 61.07,10.86 | v62.94,8.53 61.25,8.53 R15.2
  pour Route3: 74.59,-1.32 74.59,9.38 77.99,9.38 77.99,27.93 67.74,27.93 65.69,25.88 37.59,25.88 33.79,22.08 33.79,-1.32
+5V  (via drill 0.35 pad 0.7)
  Top 0.3: U1.8 52.14,20.6 v51.66,20.12
  Top 0.8: D2.C 27.7,8.08 | 27.7,8.08 27.7,5.95 D3.C | C9.2 27.86,7.92 27.7,8.08 | C9.2 C10.+ 32.16,7.93 IC4.3 | C9.2 29.01,6.97 v29.09,6.88 v29.99,6.88 v30.89,6.88 31.39,7.38 | 31.69,7.68 31.39,7.38 | 31.39,7.38 29.49,7.38
  Route3 0.3: v31.49,10.88 31.49,15.08 32.29,15.88
  Route3 0.5: v51.66,20.12 50.82,19.28 47.44,19.28 45.99,17.83 42.09,17.83 40.99,16.73 39.09,16.73 37.87,15.51 JP5.3
  Route3 0.8: JP5.3 31.49,15.48 32.29,15.88
  Bottom 0.5: R6.2 30.27,10.82 TP4.TP 30.38,10.88 v31.49,10.88
  pour Route3: 27.09,-0.92 32.99,-0.92 32.99,17.18 25.89,17.18 25.89,9.38 27.09,8.18
+5V_REGLER  (via drill 0.35 pad 0.7)
  Top 0.8: IC3.3 27.49,17.88 25.39,15.78 24.89,15.78 | 24.89,15.78 24.37,15.78 C8.+ 22.8,15.83 C7.2 | D2.A 26.39,14.39 v26.29,14.39 24.89,15.78
  Bottom 0.5: TP3.TP 27.63,10.81 R5.2 27.3,12.38 26.29,13.38 v26.29,14.38 v26.29,14.39
+5V_USB  (via drill 0.35 pad 0.7)
  Top 0.3: IC5.19 C27.+ | IC5.1 82.85,18.33 C29.2
  Top 0.5: IC1.5 89.74,21.69 v89.74,20.58 v89.75,20.58 R13.2 | v91.3,24.32 TP8.TP | L1.3 84.39,15.62 C1.2 v83.36,16.63 | C27.+ 85.35,28.46 C26.2 85.34,28.49 v85.34,29.23 | R11.1 v90.79,32.68 R12.2 88.84,32.68 87.94,31.78 R10.2 | C29.2 82.86,17.13 v83.36,16.63 | v83.36,16.63 | R22.1 v80.19,13.88 81.42,15.11 OC2.6 | OC1.1 81.69,27.25 v81.69,28.18
  pour Route3: 79.29,9.93 79.29,28.63 88.09,33.68 94.99,33.68 94.99,8.18 90.69,8.18 88.64,9.93
+5V_USB_SUP  (via drill 0.35 pad 0.7)
  Top 0.5: v20.84,13.68 IC2.5
  Top 0.8: D3.A 25.25,2.96 C2.2 23.42,2.98 L2.3 23.05,2.03 v23.09,1.98 v24.29,1.98 v25.49,1.98 25.99,2.48 | 26.39,2.88 25.99,2.48 | 25.99,2.48 23.29,2.48
  Bottom 0.5: TP2.TP R4.2 24.75,12.48 v23.79,12.48
  pour Route3: 15.09,14.88 23.49,14.88 25.09,13.28 25.09,8.98 26.29,7.78 26.29,-0.92 15.09,-0.92
+12V  (via drill 0.35 pad 0.7)
  Top 0.7: v26.29,115.58 v27.04,115.78 v26.84,115.03 | v26.29,115.58 v26.84,115.03 | v26.29,115.58 25.61,114.9 C44.2 | v26.84,115.03 26.19,114.38 25.59,114.38 | v10.44,91.82 v10.93,92.42 v11.21,91.69 | v10.44,91.82 v11.21,91.69 | v53.29,125.16 v54.02,124.88 v53.41,124.39 | v53.29,125.16 v53.41,124.39 | v80.93,117.49 v81.35,116.84 v80.58,116.8 | v80.93,117.49 v80.58,116.8 | v98.24,94.63 v98.2,93.86 v97.55,94.28 | v98.24,94.63 v97.55,94.28 | v99.4,65.98 v98.91,65.37 v98.63,66.1 | v99.4,65.98 v98.63,66.1 | v83.44,42.28 v82.69,42.08 v82.89,42.83 | v83.44,42.28 v82.89,42.83 | v56.55,32.86 v55.82,33.14 v56.42,33.63 | v56.55,32.86 v56.42,33.63 | v29.18,40.67 v28.76,41.32 v29.53,41.36 | v29.18,40.67 v29.53,41.36 | v11.94,63.44 v11.98,64.22 v12.63,63.8 | v11.94,63.44 v12.63,63.8 | v11.94,63.44 12.34,62.63 | v12.63,63.8 13.14,62.83 C52.2 12.29,63.58 | v10.44,91.82 10.29,90.93 C68.2 | v11.21,91.69 11.04,90.68 10.74,91.43 | v53.41,124.39 52.63,124.27 C64.2 | v53.29,125.16 52.49,125.03 53.09,124.73 | v80.58,116.8 79.84,117.18 C72.2 | v80.93,117.49 79.94,117.98 80.59,117.23 | v97.55,94.28 97.09,95.13 C48.2 | v98.24,94.63 97.74,95.53 97.84,94.73 | v98.63,66.1 98.74,66.78 C60.2 | v99.4,65.98 99.54,67.13 99.09,66.38 | v82.89,42.83 83.44,43.38 C40.2 | v83.44,42.28 84.14,42.98 83.39,42.73 | v56.42,33.63 57.34,33.78 56.69,33.23 | v56.55,32.86 57.49,33.03 C56.2 | v29.53,41.36 30.24,40.98 C76.2 | v29.18,40.67 30.04,40.23 29.64,40.83 | v28.79,107.93 v28.43,108.55 v28.07,107.93 | v28.07,107.93 v28.79,107.93 | v16.81,86.72 v16.15,87.01 v16.22,86.29 | v16.22,86.29 v16.81,86.72 | v50.49,117.57 v50.57,118.28 v49.91,117.99 | v49.91,117.99 v50.49,117.57
  Top 0.7: v74.22,112.96 v74.7,113.5 v73.99,113.66 | v73.99,113.66 v74.22,112.96 | v36.05,45.21 v35.56,44.67 v36.27,44.52 | v36.27,44.52 v36.05,45.21 | v20.03,63.08 v19.33,62.93 v19.81,62.39 | v19.81,62.39 v20.03,63.08 | v90.18,94.96 v90.88,95.11 v90.4,95.65 | v90.4,95.65 v90.18,94.96 | v93,70.92 v93.66,70.63 v93.59,71.35 | v93.59,71.35 v93,70.92 | v81.22,50.15 v81.58,49.53 v81.94,50.15 | v81.94,50.15 v81.22,50.15 | v59.23,40.45 v59.16,39.73 v59.82,40.02 | v59.82,40.02 v59.23,40.45 | D60.3 v74.22,112.96 | v73.99,113.66 73.49,113.23 73.29,112.78 | v50.49,117.57 D50.3 | v49.91,117.99 49.74,117.43 49.89,116.78 | v28.79,107.93 D25.3 | v28.07,107.93 28.24,107.03 28.74,106.63 | v16.81,86.72 D55.3 | v16.22,86.29 16.89,86.03 17.54,85.98 | v20.03,63.08 D35.3 | v19.81,62.39 20.59,62.58 20.99,62.93 | v36.05,45.21 D67.3 | v36.27,44.52 36.79,45.28 36.79,45.53 | v59.23,40.45 D40.3 | v59.82,40.02 59.99,40.98 59.64,41.53 | v81.22,50.15 D20.3 | v81.94,50.15 81.49,50.83 81.09,51.13 | v93,70.92 D45.3 | v93.59,71.35 92.79,71.73 92.19,71.78 | v90.18,94.96 D30.3 | v90.4,95.65 89.49,95.43 89.04,95.08 | v77.5,114.58 v78.13,114.93 v78.12,114.21 v77.5,114.58 | v93.78,94.25 v94.5,94.21 v94.1,93.6 v93.78,94.25 | v28.03,111.45 v27.84,112.15 v28.54,111.96 v28.03,111.45 | v14.21,89.45 v13.65,89.91 v14.33,90.17 v14.21,89.45 | v16.4,63.82 v15.68,63.85 v16.07,64.46 v16.4,63.82 | v95.48,68.3 v96.04,67.85 v95.36,67.59 v95.48,68.3 | v81.71,46.46 v81.9,45.77 v81.2,45.96 v81.71,46.46 | v32.61,43.61 v32.01,43.21 v31.97,43.94 v32.61,43.61 | v57.53,37.27 v57.27,36.6 v56.81,37.16 v57.53,37.27 | v52.28,120.77 v52.54,121.45 v53,120.88 v52.28,120.77
  Top 0.8: 84.07,43.51 C40.2 IC10.5 v81.9,45.77 | 12.86,62.41 C52.2 IC13.5 v15.68,63.85 | 97.3,95.64 C48.2 IC12.5 v94.5,94.21 | 10.57,90.44 C68.2 IC17.5 v13.65,89.91 | 99.16,67.31 C60.2 IC15.5 v96.04,67.85 | 57.76,33.5 C56.2 IC14.5 v57.27,36.6 | 30.54,40.42 C76.2 IC19.5 v32.01,43.21 | 79.57,117.74 C72.2 IC18.5 v78.13,114.93 | 52.05,124.55 C64.2 IC16.5 v52.54,121.45 | IC3.1 26.1,25.2 C6.1 18.94,25.2 C5.2 | v18.29,26.28 v17.49,26.28 17.49,25.98 v17.89,25.58 | v17.89,25.58 18.29,25.98 v18.29,26.28 | v18.29,26.28 18.99,25.58 | 18.99,25.58 18.99,25.18 18.29,25.18 v17.89,25.58 | 18.99,25.58 19.38,25.2 19.82,25.2 | C44.2 IC11.5 27.04,112.93 v27.84,112.15 | C44.2
  Top 1: 19.87,29.42 C4.1 19.87,30.48 20.74,30.48 21.09,30.48 | 19.29,31.08 v18.89,31.48 | 20.99,29.68 v21.99,29.98 | 19.19,30.28 v18.89,30.58 | 17.99,30.58 v17.49,31.08 18.49,31.08
  Top 1.2: C3.2 19.87,29.42 | 21.56,29.42 21.12,29.42 20.99,29.68 v18.89,29.68 17.89,29.68 v17.49,30.08 v17.49,31.08 17.89,31.48 v18.89,31.48 | v20.69,31.28 v21.99,29.98 v20.69,29.98 | v20.69,31.28 19.29,31.08 | v20.69,29.98 19.19,30.28 | v18.89,30.58 17.99,30.58 | 18.49,31.08 v18.89,31.48 | v18.89,31.48 v20.69,31.28 | v20.69,29.98 20.74,30.48
  Bottom 0.7: v77.5,114.58 v78.12,114.21 v78.13,114.93 v77.5,114.58 | v93.78,94.25 v94.1,93.6 v94.5,94.21 v93.78,94.25 | v28.54,111.96 v27.84,112.15 v28.03,111.45 | v28.54,111.96 v28.03,111.45 | v28.43,108.55 v28.07,107.93 v28.79,107.93 v28.43,108.55 | v14.33,90.17 v13.65,89.91 v14.21,89.45 | v14.33,90.17 v14.21,89.45 | v16.07,64.46 v15.68,63.85 v16.4,63.82 | v16.07,64.46 v16.4,63.82 | v95.48,68.3 v95.36,67.59 v96.04,67.85 v95.48,68.3 | v81.9,45.77 v81.2,45.96 v81.71,46.46 | v81.71,46.46 v81.9,45.77 | v32.01,43.21 v31.97,43.94 v32.61,43.61 | v32.61,43.61 v32.01,43.21 | v57.53,37.27 v56.81,37.16 v57.27,36.6 v57.53,37.27 | v16.15,87.01 v16.22,86.29 v16.81,86.72 v16.15,87.01 | v52.28,120.77 v53,120.88 v52.54,121.45 v52.28,120.77 | v49.91,117.99 v50.49,117.57 v50.57,118.28 | v49.91,117.99 v50.57,118.28 | v73.99,113.66 v74.22,112.96 v74.7,113.5 | v73.99,113.66 v74.7,113.5 | v35.56,44.67 v36.27,44.52 v36.05,45.21 v35.56,44.67 | v19.33,62.93 v19.81,62.39 v20.03,63.08 v19.33,62.93 | v90.4,95.65 v90.18,94.96 v90.88,95.11 | v90.4,95.65 v90.88,95.11 | v93.59,71.35 v93,70.92 v93.66,70.63 | v93.59,71.35 v93.66,70.63 | v81.58,49.53 v81.94,50.15 v81.22,50.15 v81.58,49.53 | v59.23,40.45 v59.82,40.02 v59.16,39.73 | v59.16,39.73 v59.23,40.45 | v74.7,113.5 v77.5,114.58 | v73.99,113.66 v78.14,114.93 v78.13,114.21 v74.21,112.96 | v90.88,95.11 v93.78,94.25 | v90.4,95.65 v94.5,94.21 v94.11,93.6 v90.18,94.97 | v93.66,70.63 v95.48,68.3 | v93.59,71.35 v96.04,67.85 v95.36,67.59 v93,70.92 | v81.58,49.53 v81.71,46.46 | v81.9,45.77 81.94,50.18 v81.22,50.15 v81.2,45.95 | v57.53,37.27 v59.16,39.73 | v59.23,40.45 v56.81,37.15 v57.27,36.6 v59.82,40.02
  Bottom 0.7: v32.61,43.61 v35.56,44.67 | v32.01,43.21 v36.28,44.52 v36.05,45.21 v31.97,43.94 | v16.4,63.82 v19.33,62.93 | v16.07,64.46 v20.03,63.08 v19.81,62.39 v15.68,63.85 | v14.21,89.45 v16.15,87.01 | v14.33,90.17 v16.81,86.72 v16.22,86.29 v13.65,89.91 | v28.03,111.45 v28.43,108.55 | v28.54,111.96 v28.79,107.92 v28.07,107.93 v27.84,112.15 | v50.57,118.28 v52.28,120.77 | v49.91,117.99 v52.54,121.45 v53,120.88 v50.49,117.57 | v27.04,115.78 v26.84,115.03 v26.29,115.58 v27.04,115.78 | v10.93,92.42 v11.21,91.69 v10.44,91.82 v10.93,92.42 | v54.02,124.88 v53.41,124.39 v53.29,125.16 v54.02,124.88 | v81.35,116.84 v80.58,116.8 v80.93,117.49 v81.35,116.84 | v98.2,93.86 v97.55,94.28 v98.24,94.63 v98.2,93.86 | v98.91,65.37 v98.63,66.1 v99.4,65.98 v98.91,65.37 | v82.69,42.08 v82.89,42.83 v83.44,42.28 v82.69,42.08 | v55.82,33.14 v56.42,33.63 v56.55,32.86 v55.82,33.14 | v28.76,41.32 v29.53,41.36 v29.18,40.67 v28.76,41.32 | v11.98,64.22 v12.63,63.8 v11.94,63.44 v11.98,64.22
  Bottom 1.7: 37.29,34.66 D1.C 35.49,31.43 | 35.49,31.43 38.09,29.96 | 35.49,31.43 32.57,33.06
  pour Bottom (rank 2): 54.34,41.39 54.34,26.38 52.89,28.38 38.69,28.38 34.99,22.68 16.1,22.68 16.1,43.62 arc-42 2.49,78.88 arc-90 54.99,131.38 arc-90 107.49,78.88 arc-90 54.99,26.38 54.99,41.38 arc90 92.49,78.88 arc90 54.99,116.38 arc90 17.49,78.88 arc89
CODE_0  (via drill 0.35 pad 0.7)
  Top 0.3: U1.53 59.26,14.06 v63.82,9.51 64.19,9.13 68.74,4.58 68.74,3.01 JP3.7 | RN1.1 65.79,12.08 v65.79,11.38
  Bottom 0.3: v65.79,11.38 63.92,9.51 v63.82,9.51
CODE_1  (via drill 0.35 pad 0.7)
  Top 0.3: U1.54 59.72,14.57 v65.17,9.12 65.4,8.89 JP3.5 | RN1.2 66.59,12.08 v66.59,10.68
  Bottom 0.3: v66.59,10.68 65.17,9.27 v65.17,9.12
CODE_2  (via drill 0.35 pad 0.7)
  Top 0.3: U1.55 60.22,15.05 v66.42,8.86 66.69,8.58 68.79,6.48 JP3.3 | RN1.3 67.39,12.08 v67.39,9.83
  Bottom 0.3: v67.39,9.83 v66.42,8.86
CODE_3
  Top 0.3: U1.56 60.66,15.56 67.57,8.66 | 67.57,8.66 68.22,8.01 69.33,8.01 JP3.1 | RN1.4 68.17,9.27 67.57,8.66
GND  (via drill 0.35 pad 0.7)
  Top 0.3: v84.3,40.39 R30.1 | v9.78,63.1 R36.1 | v82.42,118.92 R46.1 | v101.17,64.89 R40.1 | v8.51,92.82 R44.1 | v56.13,30.76 R38.1 | v53.7,127.21 R42.1 | v25.36,117.44 R32.1 | v100.33,94.91 R34.1 | U1.16 48.07,21.4 v48.07,20.26 48.63,20.82 U1.15 | U1.47 55.13,10.95 v54.56,11.52 | v47.81,12.17 47.42,12.57 U1.31 | v42.21,11.62 42.21,10.67 42.91,10.67 42.91,9.82 Q1.GND1 | 20.81,3.94 20.74,3.88 20.74,3.45 | IC2.2 20.79,10.01 20.79,9.08 v20.49,8.78 | U1.4 54.14,22.92 C20.- | v26.59,38.74 26.79,39.18 R48.1
  Top 0.5: X2.5 20.81,3.94 21.45,3.94 21.49,3.98 | PROG.3 PROG.5 44.76,24.01 v45.39,23.38 44.79,22.78 43.54,22.78 | OC1.5 v76.99,28.48 | C20.- 57.59,24.67 C21.1 57.63,24.68 v58.69,24.68 | X2.GND4 X2.GND3 X2.GND1 17.64,9.07 v17.64,10.83 | v19.24,1.48 X2.GND2 17.57,4.06 17.69,4.18
  Top 0.61: 7,87.39 D57.A
  Top 0.7: v32.64,107.83 v32.84,107.08 v32.09,107.28 | v32.64,107.83 v32.09,107.28 | v32.64,107.83 31.74,108.73 31.19,108.73 | v32.09,107.28 31.19,108.18 31.19,108.73 | 31.19,108.73 32.29,107.63 32.34,107.63 | v21.25,67.04 v22.02,67 v21.6,66.35 | v21.25,67.04 v21.6,66.35 | v34.64,49.06 v35.29,49.49 v35.33,48.71 | v34.64,49.06 v35.33,48.71 | v55.95,42.92 v56.23,43.64 v56.71,43.04 | v55.95,42.92 v56.71,43.04 | v77.14,50.13 v76.94,50.88 v77.69,50.68 | v77.14,50.13 v77.69,50.68 | v89.66,68.54 v89.05,69.03 v89.78,69.3 | v89.66,68.54 v89.78,69.3 | v88.93,90.98 v88.16,91.02 v88.58,91.67 | v88.93,90.98 v88.58,91.67 | v75.53,109.02 v74.88,108.6 v74.84,109.38 | v75.53,109.02 v74.84,109.38 | v53.91,115.14 v53.63,114.41 v53.14,115.01 | v53.91,115.14 v53.14,115.01 | v21.6,66.35 20.54,65.78 R37.2 | v21.25,67.04 20.29,66.53 21.24,66.53 | v20.08,89.23 v20.68,88.74 v19.95,88.46 | v20.08,89.23 v19.95,88.46 | v19.95,88.46 18.99,88.63 R45.2 | v20.08,89.23 18.79,89.43 19.79,88.83 | v53.14,115.01 52.94,116.08 R43.2 | v53.91,115.14 53.74,116.08 53.54,115.48 | v74.84,109.38 75.24,110.18 R47.2 | v75.53,109.02 75.89,109.78 75.44,109.58 | v88.58,91.67 89.44,92.13 R35.2 | v88.93,90.98 90.04,91.53 88.99,91.48 | v89.78,69.3 90.59,69.18 R41.2 | v89.66,68.54 90.99,68.33 89.84,68.93 | v77.14,50.13 77.59,49.68 R31.2 | v77.69,50.68 78.54,49.83 77.69,50.13 | v56.71,43.04 56.84,42.28 R39.2 | v55.95,42.92 56.14,41.78 56.49,42.83 | v35.33,48.71 34.94,47.98 34.84,48.48 R49.2 | v34.64,49.06 34.19,48.18
  Top 0.8: IC10.2 78.55,49.06 R31.2 78.55,49.24 | 88.75,43.91 D22.A | v87.23,40.43 87.36,40.7 87.21,40.4 | v89.04,41.91 v89.02,41.91 | v87.52,42.65 87.48,42.64 | IC13.2 19.85,65.95 R37.2 20.02,65.89 | 11.8,57.83 D37.A 11.77,57.56 | v8.95,60.4 9.33,59.92 9.57,59.61 8.93,60.39 | v9.81,58.23 9.8,58.19 | v10.95,59.43 10.98,59.44 | IC12.2 90.31,92.11 R35.2 90.14,92.16 | 98.36,100.22 D32.A | C50.1 101.77,99.4 | C46.1 20.69,117.47 | 48.02,126.98 D52.A | C66.1 49.85,129.97 | C68.1 7.56,90.9 | 62.02,31.11 D42.A | C58.1 59.95,28.08 | 102.71,70.39 D47.A | C62.1 104.99,67.72 | 77.74,122.07 D62.A | C74.1 80.98,123.41 | 32.38,36.1 D69.A | C78.1 29.13,34.75 | C70.1 4.75,90.03 | 7.02,87.36 D57.A | v101.25,97.71 101.25,97.68 101.23,97.67 | v99.16,98.63 99.18,98.62 | v100.35,99.87 100.35,99.86 | v20.68,115.97 20.69,115.97 | v22.24,115.23 22.23,115.24 | v22.48,117.5 22.5,117.48 | v6.15,91.09 6.18,91.12 6.2,91.11 | v5.67,88.86 5.62,88.83 | v7.31,89.15 7.3,89.14 | v102.42,68.6 102.43,68.62 | v104.11,68.95 104.11,68.93 | v103.53,66.66 103.55,66.64 103.53,66.64 | v51.31,128.92 51.33,128.94 51.33,128.91 | v49.78,127.25 v49.79,127.26 | v48.98,128.78 48.98,128.76 | v60.83,29.32 60.83,29.29 | v58.5,29.14 58.48,29.11 58.48,29.14 | v60.03,30.8 60.01,30.79 | v30.55,35.26 30.55,35.22 | v30.77,36.93 30.78,36.91 | v28.54,36.47 28.55,36.45 28.56,36.47 | v79.34,121.23 79.34,121.25 | v79.56,122.96 v79.56,122.95 | v81.57,121.74 81.57,121.71 81.55,121.69 | 31.17,108.82 R33.2 | 31.17,108.64 R33.2 | IC17.2 18.31,89.2 R45.2 18.41,89.05 | IC15.2 91.43,68.56 R41.2 91.32,68.71 | IC14.2 56.56,41.24 R39.2 56.66,41.38 | IC19.2 34.12,47.39 R49.2 34.29,47.45 | 75.82,110.71 R47.2 75.99,110.77 IC18.2 | IC16.2 53.25,116.81 R43.2 53.14,116.67
  Top 0.8: C6.2 18.67,20.38 C5.1 18.02,21.78 | v18.79,21.48 v20.79,21.48 | v20.79,21.48 21.39,21.48 | v20.79,21.48 v19.79,20.48 v18.79,21.48 | v18.79,21.48 18.5,21.78 | 18.5,21.78 18.02,21.78 | 18.02,21.78 18.81,20.98 21.19,20.98 | 18.5,21.78 21.59,21.78 | C7.1 22.78,18.27 v23.19,18.68 v24.09,18.68 | C8.- 24.33,18.45 v24.09,18.68 | v24.09,18.68 22.99,17.58 24.29,17.58 | v29.09,10.68 29.09,9.75 C9.1 29.02,9.68 C10.- 30.56,9.78 v31.59,9.78 | C11.1 35.65,11.68 | 35.65,11.68 C12.- 36.41,10.1 v36.69,10.18 | 35.65,11.68 36.08,11.68 | 36.08,11.68 36.4,11.68 v36.69,11.38 36.69,8.09 IC4.1 | 36.08,11.68 36.08,10.3 36.09,10.28 | 21.49,3.98 22.46,4.95 L2.2 23.27,4.73 C2.1 25.29,4.79 v25.29,5.78 | 21.45,3.94 20.99,3.48 v20.99,3.18 | IC11.2 31.17,108.82 | 31.17,108.82 R33.2 | 31.19,108.73 R33.2
  Top 1: 22.07,35.5 23.19,34.38 23.19,34.28 23.99,35.08 v23.99,38.28 | 22.07,35.5 C4.2 | 20.89,38.28 v22.24,38.28 | v22.24,38.28 v23.99,38.28 | v23.99,38.28 23.89,38.28 v23.09,38.98 | v23.09,38.98 v23.79,39.78 v22.24,39.78 | v22.24,39.78 v20.49,39.78 v20.49,38.28 20.89,38.28 | v22.24,38.28 v21.34,38.98 | 20.89,38.28 v22.24,39.78 | v22.24,39.78 22.29,38.38 v22.24,38.28 | C4.2 19.87,37.56 v21.34,38.98 | 22.07,35.5 23.99,37.42 v23.99,38.28 | v23.99,38.28 23.29,38.98 v23.09,38.98 | v23.09,38.98 v21.34,38.98 | v21.34,38.98 20.69,38.38 20.69,36.08 20.89,36.28 22.09,36.28 23.19,37.38 | 23.19,37.38 23.19,37.48 | 23.19,37.48 23.19,37.88 22.89,37.58 21.49,37.58 21.39,37.48 21.39,36.88 21.59,37.08 22.29,37.08 | v23.99,38.28 23.19,37.48 | 23.19,37.38 23.19,35.08 | C4.2 19.87,35.08 23.89,35.08
  Top 1.2: C40.1 87.21,40.4 C42.1 | C40.1 87.48,42.64 88.75,43.91 | D22.A 89.02,43.97 v89.02,41.91 89.02,40.38 | 11.8,57.83 10.98,59.44 C52.1 8.93,60.39 C54.1 | 11.77,57.56 9.8,58.19 8.35,58.67 | 98.36,100.22 99.18,98.62 C48.1 101.23,97.67 C50.1 100.29,97.98 99.59,99.38 100.59,99.18 | 101.77,99.4 100.35,99.86 98.22,100.56 | D27.A 20.96,113.97 22.23,115.24 C44.1 22.5,117.48 C46.1 22.64,116.63 21.39,115.08 21.24,116.58 | 20.69,117.47 20.69,115.97 20.69,113.55 | 48.02,126.98 v49.79,127.26 C64.1 51.33,128.91 C66.1 50.84,127.98 48.89,127.68 49.74,128.78 | 49.85,129.97 48.98,128.76 47.55,126.8 | C56.1 60.01,30.79 62.02,31.11 | C56.1 58.48,29.14 C58.1 | 59.95,28.08 60.83,29.29 62.25,31.25 | 102.71,70.39 102.43,68.62 C60.1 103.53,66.64 C62.1 102.89,67.43 103.04,69.33 103.94,68.23 | 104.99,67.72 104.11,68.93 102.79,70.75 | 77.74,122.07 79.34,121.25 C72.1 81.55,121.69 C74.1 80.89,121.38 79.24,122.03 80.19,122.53 | 80.98,123.41 v79.56,122.95 77.42,122.25 | C76.1 30.78,36.91 32.38,36.1 | C76.1 28.56,36.47 C78.1 | 29.13,34.75 30.55,35.22 32.86,35.97 | 4.75,90.03 5.62,88.83 6.11,88.16 | 6.11,88.16 6.73,87.3 | 7.02,87.36 7.3,89.14 C68.1 6.2,91.11 C70.1 | C3.1 23.19,32.2 23.19,34.28 | C40.1 88.54,42.73 88.54,41.43 87.24,40.98 | C56.1 60.84,30.33 59.79,29.28 58.89,29.58 | C76.1 30.99,36.13 29.59,35.78 29.24,36.33 | 9.33,59.92 10.19,59.43 10.74,58.43 9.14,59.23 | 6.11,88.16 6.04,90.48 6.94,90.33 6.69,88.73
  Bottom 0.3: 48.07,19.16 C25.1 | 48.07,19.08 C25.1 | 48.2,19.03 C25.1 | v50.12,16.08 C13.1
  Bottom 0.5: v48.07,20.26 48.07,19.16 | v48.2,18.23 48.2,19.03 | D5.C 24.89,17.11 D6.C 27.73,17.09 v28.97,17.09 | TP6.TP 32.49,17.11 D8.C v31.37,17.09 v31.37,17.08 D7.C | D4.C 30.19,19.14 D7.C v28.97,17.09 | C22.2 v52.39,16.24 v52.39,16.23 | v28.97,17.09 v28.97,17.08
  Bottom 0.7: v32.84,107.08 v32.09,107.28 v32.64,107.83 v32.84,107.08 | v22.02,67 v21.6,66.35 v21.25,67.04 v22.02,67 | v35.29,49.49 v35.33,48.71 v34.64,49.06 v35.29,49.49 | v56.23,43.64 v56.71,43.04 v55.95,42.92 v56.23,43.64 | v76.94,50.88 v77.69,50.68 v77.14,50.13 v76.94,50.88 | v89.05,69.03 v89.78,69.3 v89.66,68.54 v89.05,69.03 | v88.16,91.02 v88.58,91.67 v88.93,90.98 v88.16,91.02 | v74.88,108.6 v74.84,109.38 v75.53,109.02 v74.88,108.6 | v53.63,114.41 v53.14,115.01 v53.91,115.14 v53.63,114.41 | v20.68,88.74 v19.95,88.46 v20.08,89.23 v20.68,88.74
  Bottom 1: PJ1.2 v21.34,38.98
  Bottom 3: PJ1.2 PJ1.3
  other vias: 41.96,5.97 46.21,10.42 47.26,6.92 27.49,38.08 28.09,39.38 20.49,36.58 21.09,35.28 21.69,36.58 22.89,36.58 22.39,35.28 23.69,35.28 50.21,128.42 80.27,121.94 100.5,98.56 103.47,68 87.87,41.45 59.6,29.64 29.79,36.13 9.65,59.55 6.35,89.79 21.93,116.47 57.04,28.98 58.74,27.18 65.19,26.93 67.99,28.96 70.22,33.38 72.69,32.36 73.52,35.86 75.89,34.71 74.92,40.26 78.84,36.58 80.62,38.91 78.82,40.36 77.22,40.48 76.22,42.96 73.82,45.13 75.27,49.21 76.34,54.53 80.24,55.51 80.07,58.61 85.42,61.11 83.92,63.73 86.69,65.01 85.67,69.28 90.09,76.11 94.52,80.13 97.82,85.46 100.24,84.51 103.17,86.38 102.29,88.73 100.67,91.11 98.67,89.66 89.57,80.68 71.97,48.91 96.12,88.26 92.52,86.26 88.99,89.16 85.04,90.33 84.87,97.31 80.54,100.56 81.22,104.23 76.44,107.93 68.24,108.18 65.47,112.13 64.47,110.08 59.77,113.73 45.54,114.43 42.59,113.38 38.72,118.68 34.57,118.36 34.74,120.96 33.02,122.78 30.27,121.38 28.97,118.86 31.24,117.28 32.57,117.31 36.07,112.28 34.29,108.91 35.62,106.31 31.04,104.33 30.47,99.81 27.14,99.18 25.97,93.56 23.27,92.61 24.17,86.98 20.72,83.41 18.27,78.21 14.69,78.06 11.02,71.86 8.89,73.93 6.24,72.56 7.44,69.58 9.42,67.23 11.44,68.53 12.52,102.26 14.47,100.93 10.39,96.21 10.37,98.86 10.17,100.98 13.97,98.43 13.27,96.03 11.19,105.76 8.62,105.93 13.14,112.11 18.19,113.28 16.42,115.23 23.62,118.66 23.57,121.73 28.17,122.71 30.84,126.43 36.47,126.41 41.74,130.13 45.57,127.96 53.22,128.38 57.62,128.66 60.44,127.66 62.49,127.61 63.12,125.23 61.79,123.51 60.37,123.73 57.32,126.63 68.37,127.93 67.67,130.21 74.39,128.31 76.34,124.23 83.02,120.58 86.27,120.88 86.74,117.08 90.72,116.28 91.94,111.56 99.27,107.68 98.39,103.01 101.94,96.31 105.62,93.23 103.89,89.26 107.47,83.76 105.57,81.13 107.67,75.48 104.29,72.73 102.52,65.21 100.97,60.11 99.54,58.61 95.47,59.33 95.39,56.31 99.12,61.66 96.59,61.63 96.47,53.38 98.89,56.36 99.02,51.36 96.17,45.66 91.14,44.63 85.64,39.38 82.64,35.28 80.42,36.76 77.89,32.91 70.97,35.03 64.39,34.78 64.84,32.51 59.49,33.73 52.14,29.88 52.24,32.08 51.69,33.71 50.22,34.88 48.99,34.18 47.32,34.56 46.22,33.51 48.49,30.26 49.04,28.43 64.59,30.46 44.74,30.63 41.39,30.48 45.32,28.13 38.77,28.26 20.19,43.83 24.99,42.16 25.97,45.08 24.07,46.26 22.39,47.38 20.12,46.06 21.29,41.61 43.19,36.23 45.14,38.11 42.02,42.66 44.74,46.88 44.82,52.93 49.04,56.48 52.37,66.86 51.69,61.56 59.14,68.96 57.49,66.26 65.14,71.13 66.09,78.86 69.34,84.21 65.32,84.78 73.19,87.81 80.44,88.78 83.02,91.88 87.77,99.88 84.14,103.88 87.42,106.93 86.12,111.21 84.64,112.13 89.49,111.96 87.69,115.41 84.89,115.93 89.94,113.78 57.47,91.16 49.99,90.28 44.97,86.31 43.17,79.43 45.54,71.76 61.94,88.96 25.39,55.96 24.22,100.18 26.92,67.28 11.29,49.11
  pour Route2: 9.03,-7.07 9.03,32.92 arc-270 100.95,32.92 100.89,35.13 77.99,35.13 77.99,8.63 88.09,8.63 88.09,-7.07
  pour Top: 48.56,11.67 48.61,12.57 44.66,12.57 42.61,12.62 41.41,11.22 40.51,11.22 38.26,8.97 38.26,8.02 43.61,2.67 45.01,2.67 48.61,6.27 48.61,10.62
  pour Route3 (rank 2): 54.99,133.88 arc-90 109.99,78.88 arc-90 54.99,23.88 arc-90 -0.01,78.88 arc-90
GND-USB  (via drill 0.35 pad 0.7)
  Top 0.3: IC5.20 84.85,25.63 84.29,26.18 v84.29,26.73 | IC5.4 84.35,19.78 84.64,19.48 84.64,18.4 C29.1 | IC5.24 82.65,25.13 v81.59,25.13 81.59,24.18 81.89,23.89 IC5.26 | IC5.17 87.1,25.69 C27.-
  Top 0.5: 89.14,15.03 88.49,15.03 87.48,14.02 L1.2 84.54,14.02 C1.1 | 89.14,15.03 X1.5 | v91.27,25.63 TP7.TP | v89.74,18.23 89.74,19.39 IC1.2 | v89.14,15.83 89.14,15.03 | C27.- 87.1,28.44 C26.1 87.04,28.49 v87.04,29.23 | 88.14,26.33 88.19,26.38 C28.1 | v85.64,18.28 84.59,18.28 C29.1 | 88.38,26.63 C28.1 | C28.1 88.39,26.64 v88.39,27.48 | OC2.5 v83.19,13.83 84.44,13.83 | X1.GND1 X1.GND3 X1.GND4 X1.GND2 92.54,17.54 v92.54,19.28 | v90.69,9.83 92.39,9.83 92.49,9.93
  pour Route2: 79.29,9.93 79.29,33.83 94.99,33.83 94.99,8.18 90.69,8.18 88.64,9.93
LED0
  Top 0.3: U1.42 52.64,7.43 54.39,5.68 55.21,5.68 JP8.1
  Bottom 0.5: D11.C 56.97,4 JP8.1
LED1
  Top 0.3: U1.41 52.14,7.09 54.04,5.18 55.04,5.18 55.69,4.53 55.69,2.66 JP8.2
  Bottom 0.5: D12.C 55.67,2.69 JP8.2
LED2
  Top 0.3: U1.40 51.63,6.73 JP8.3
  Bottom 0.5: D13.C 54.4,3.98 JP8.3
LED_WHITE8  (via drill 0.35 pad 0.7)
  Top 0.3: 34.74,93.93 v34.74,93.43 | 30.41,75.2 v30.41,74.86
  Top 0.7: v30.41,74.86 v31.33,74.86 v30.83,75.56 v29.91,75.56 v29.49,74.86 v30.41,74.86 | v30.41,74.86 30.41,75.21 | v34.74,93.43 v35.39,92.78 v35.54,93.63 v34.89,94.28 v34.09,94.08 v34.74,93.43 | v34.74,93.43 34.99,93.68
  Top 0.8: D59.A
  Top 1.2: D58.C 34.74,93.93 | D59.A 30.41,75.2
  Bottom 0.3: 35.23,93.43 v34.74,93.43 | 30.75,75.2 v30.41,74.86
  Bottom 0.7: v30.41,74.86 v31.33,74.86 v30.83,75.56 v29.91,75.56 v29.49,74.86 v30.41,74.86 | v30.41,74.86 30.41,75.21 | v34.74,93.43 v35.39,92.78 v35.54,93.63 v34.89,94.28 v34.09,94.08 v34.74,93.43 | v34.74,93.43 34.99,93.68
  Bottom 1.2: 35.23,93.43 39.91,88.76 40.53,85.8 arc32 39.1,77 37.3,75.2 30.75,75.2
MCU_UART1_RXD
  Top 0.5: OC1.4 75.15,29.78 74.04,29.78 72.86,28.6 JP1.3 74.95,25.22 R21.2
MCU_UART1_TXD
  Top 0.5: JP1.1 77.07,20.56 R24.1
MCU_UART2_RXD  (via drill 0.35 pad 0.7)
  Top 0.3: U1.59 62.72,17.06 v63.89,15.88 | v78.99,5.48 81.43,7.92 JP2.2
  Bottom 0.3: v63.89,15.88 69.39,10.38 73.59,10.38 75.04,8.93 75.04,7.13 76.69,5.48 v78.99,5.48
MCU_UART2_TXD  (via drill 0.35 pad 0.7)
  Top 0.3: U1.60 63.21,17.57 v63.89,16.88
  Bottom 0.3: v63.89,16.88 67.64,13.13 73.54,13.13 75.74,10.93 75.74,7.58 77.09,6.23 83.47,6.23 JP2.1 85.23,8
N$1
  Top 0.5: IC19.1 33.77,44.29
  Top 0.8: 33.77,44.29 36.16,43.07 C77.1
  Top 1.2: C77.1 37.32,42.51 38.54,42.91 D68.C
N$2
  Top 1.2: D67.1 39.95,46.7 40.15,46.08 D68.A
N$3
  Top 0.3: IC5.18 85.85,25.41 86.22,25.78 86.22,30.51 R10.1
N$4
  Top 0.78: IC19.6 32.23,41.48
  Top 0.8: 32.23,41.48 32.5,40.57 D69.C | 42.56,38.86 L29.1
  Top 1.2: D69.C C77.2 38.25,39.79 39.76,40.29 42.56,38.86
N$5
  Top 0.5: 27.34,33.63 27.36,33.62
  Top 0.8: 31.81,33.34 C78.2 | 38.87,31.62 L29.2
  Top 1.2: 27.36,33.62 30.44,32.06 31.3,32.34 31.81,33.34 | C78.2 33.85,32.32 36.07,33.04 38.87,31.62 | D70.A 43.23,58.82 43.23,55.98 38.71,51.47 37.13,51.43 32.83,53.61 28.86,52.21 26.53,47.63 C79.1 24.99,39.26 26.11,35.81 26.74,35.48 27.34,33.63
N$6
  Top 1.2: D70.C 37.21,65.05 arc-31 32.72,76.01 D71.A
N$7
  Top 1.2: D71.C 32.72,81.76 arc-31 37.21,92.71 D72.A
N$8
  Top 1.2: D72.C 41.16,96.67 arc-31 52.12,101.16 D73.A
N$9  (via drill 0.35 pad 0.7)
  Top 0.3: IC5.22 83.85,25.33 83.29,25.88 v82.69,25.88 | v91.85,27.54 v91.84,27.53
  Top 0.5: D9.C v91.85,27.54
  Bottom 0.5: v91.84,27.53 90.99,26.68 85.84,26.68 85.04,25.88 v82.69,25.88
N$10
  Top 0.3: U1.32 45.5,12.06 44.36,10.92 R8.2 42.08,7.27 40.78,7.27 Q1.1 40.58,7.54 C23.1
N$11
  Top 0.3: U1.33 48.12,9.43 47.04,8.35 R8.1 44.86,7.65 44.86,6.82 45.1,6.58 Q1.3 46.18,5.27 C24.1
N$12
  Bottom 0.5: D11.A 58.29,7.65 R14.1
N$13
  Top 0.5: X1.1 86.84,12.44 L1.1
N$14  (via drill 0.35 pad 0.7)
  Top 0.3: X1.2 88.79,13.09 v88.44,13.43 | v88.44,17.78 88.79,18.13 88.79,19.39 IC1.1
  Bottom 0.3: v88.44,13.43 v88.44,17.78
N$15
  Top 0.3: 90.74,19.36 IC1.3 90.7,16.68 90.94,16.43 90.94,14.08 90.6,13.74 X1.3
N$16
  Bottom 0.5: R3.1 30.21,22.08 D4.A
N$17
  Top 0.5: X2.1 20.76,6.89 21.51,6.89 21.49,6.88 21.49,6.74
  Top 0.8: L2.1 22.86,6.74 21.49,6.74 20.9,6.74
N$18
  Bottom 0.5: D5.A R4.1
N$19  (via drill 0.35 pad 0.7)
  Top 0.3: IC5.21 84.35,25.48 v83.04,26.78
  Top 0.5: v88.29,28.33 88.31,28.32 D10.C
  Bottom 0.5: v83.04,26.78 84.59,28.33 v88.29,28.33
N$20
  Top 0.7: IC19.3 31.79,45.28
  Top 0.8: 29.01,46.97 C79.2 29.34,46.53 31.79,45.28
  Top 1.2: 29.01,46.97 R49.1 31.11,51.05 33.36,51.8 37.7,49.61 39.37,49.61 45.29,55.54 45.29,68.83 arc-150 57.96,92.62 59.57,94.24 59.57,100.35 58.54,101.38 D73.C
N$21
  Top 0.5: R12.1 D10.A
N$22
  Top 0.5: R11.2 D9.A
N$23  (via drill 0.35 pad 0.7)
  Top 0.3: IC5.11 v87.79,21.89 v87.79,21.88
  Top 0.5: v91.59,21.88 92.26,21.88 R13.1
  Bottom 0.5: v87.79,21.88 v91.59,21.88
N$24
  Top 0.5: IC14.1 58.19,38.54
  Top 0.8: 58.19,38.54 60.75,38.94 C57.1
  Top 1.2: C57.1 62.01,39.17 62.77,40.21 D41.C
N$25
  Top 0.5: IC18.1 76.24,113.92
  Top 0.8: 76.24,113.92 73.95,115.09 C73.1
  Top 1.2: C73.1 72.79,115.65 71.58,115.25 D61.C
N$26
  Top 0.3: X2.2 19.59,5.89 19.09,6.38 19.09,8.48 19.89,9.28 IC2.1
N$27  (via drill 0.35 pad 0.7)
  Top 0.3: X2.3 21.25,5.24 v21.69,5.68 | v21.69,8.88 21.79,8.98 IC2.3
  Bottom 0.3: v21.69,5.68 v21.69,8.88
N$28
  Top 1.2: D60.1 70.17,111.46 69.96,112.09 D61.A
N$29
  Top 0.78: IC18.6 77.89,116.69
  Top 0.8: 77.89,116.69 77.62,117.59 D62.C | 67.55,119.3 L28.1
  Top 1.2: D62.C C73.2 71.75,118.43 70.23,117.93 67.55,119.3
N$30
  Top 0.8: 78.31,124.82 C74.2 | 71.24,126.54 L28.2
  Top 1.2: 78.31,124.82 78.81,125.82 79.67,126.1 83.4,124.19 85.12,118.9 C75.1 83.66,110.44 81.3,105.74 77.03,104.37 73.08,106.35 71.32,106.35 66.76,101.78 66.76,98.93 D63.A | C74.2 76.14,125.9 73.92,125.18 71.24,126.54
N$31
  Top 1.2: D64.A 77.26,81.76 arc31 72.77,92.71 D63.C
N$32
  Top 1.2: D65.A 72.77,65.05 arc31 77.26,76.01 D64.C
N$33
  Top 1.2: D66.A 57.87,56.61 arc31 68.82,61.1 D65.C
N$34
  Top 0.7: IC18.3 78.39,112.83
  Top 0.8: 79.97,108.79 R47.1 | 78.39,112.83 80.69,111.7 C75.2
  Top 1.2: C75.2 79.97,108.79 | R47.1 79.06,107.26 76.35,106.33 72.14,108.43 70.35,108.43 64.69,102.77 64.69,88.94 arc-148 51.76,65.23 50.14,63.62 50.14,57.51 51.27,56.39 D66.C
N$35
  Top 1.2: D40.1 61.68,44.11 62.21,43.72 D41.A
N$36
  Bottom 0.5: R15.1 56.38,8.72 55.67,8.01 D12.A
N$37
  Bottom 0.5: R16.1 57.18,10.82 54.4,8.04 D13.A
N$38
  Top 0.78: IC14.6 58.49,35.38
  Top 0.8: 58.49,35.38 59.4,34.66 61.29,34.96 D42.C | 68.4,39.3 L24.1
  Top 1.2: D42.C C57.2 64.49,37.54 65.43,38.83 68.4,39.3
N$39  (via drill 0.35 pad 0.7)
  Top 0.7: v35.69,54.33 v35.04,54.98 v34.89,54.13 v35.54,53.48 v36.34,53.68 v35.69,54.33 | v35.69,54.33 35.44,54.08 | v45.44,43.23 v44.79,43.88 v44.64,43.03 v45.29,42.38 v46.09,42.58 v45.44,43.23 | v45.44,43.23 45.19,42.98
  Top 0.8: 62.95,28.51 C58.2 | 69.67,31.27 L24.2 | C59.1 53,34.76
  Top 1.2: C59.1 53.95,29.3 58.45,26.02 62.59,26.68 63.12,27.4 62.95,28.51 | C58.2 65.33,28.91 66.7,30.8 69.67,31.27 | D43.A 35.69,54.38 v35.69,54.33 | 53,34.76 52.07,34.76 48.89,37.93 48.89,39.28 45.19,42.98
  Bottom 0.7: v35.69,54.33 v35.04,54.98 v34.89,54.13 v35.54,53.48 v36.34,53.68 v35.69,54.33 | v35.69,54.33 35.44,54.08 | v45.44,43.23 v44.79,43.88 v44.64,43.03 v45.29,42.38 v46.09,42.58 v45.44,43.23 | v45.44,43.23 45.19,42.98
  Bottom 1.2: 35.44,54.08 35.44,52.78 45.19,43.03 45.19,42.98
N$40  (via drill 0.35 pad 0.7)
  Top 0.3: 58.68,54.1 v59.02,54.1 | 39.85,58.53 v40.34,58.53
  Top 0.7: v59.02,54.1 v59.02,55.02 v58.31,54.52 v58.31,53.6 v59.02,53.18 v59.02,54.1 | v59.02,54.1 58.67,54.1 | v40.34,58.53 v40.99,59.18 v40.14,59.33 v39.49,58.68 v39.69,57.88 v40.34,58.53 | v40.34,58.53 40.09,58.78
  Top 0.8: D44.A
  Top 1.2: D44.A 58.68,54.1 | D43.C 39.85,58.53
  Bottom 0.3: 58.68,54.1 v59.02,54.1 | 40.65,59.33 v40.14,59.33
  Bottom 0.7: v59.02,54.1 v59.02,55.02 v58.31,54.52 v58.31,53.6 v59.02,53.18 v59.02,54.1 | v59.02,54.1 58.67,54.1 | v40.34,58.53 v40.99,59.18 v40.14,59.33 v39.49,58.68 v39.69,57.88 v40.34,58.53 | v40.34,58.53 40.09,58.78
  Bottom 1.2: 58.68,54.1 58.68,61.19 56.88,62.99 arc-32 48.08,64.43 45.11,63.8 40.65,59.33
N$41
  Top 0.5: IC15.1 94.49,69.25
  Top 0.8: 94.49,69.25 94.91,71.83 C61.1
  Top 1.2: C61.1 95.08,73.11 94.33,74.14 D46.C
N$42
  Top 1.2: D45.1 90.28,74.31 90.81,74.7 D46.A
N$43
  Top 0.7: IC14.3 55.94,38.18
  Top 0.8: 52.18,40.5 R39.1 52.12,40.73 | 55.94,38.18 53.24,37.68 C59.2
  Top 1.2: C59.2 52.18,40.5 | D44.C 58.68,47.01 57.6,45.93 55.62,45.93 52.12,42.42 52.12,40.73
N$44
  Top 0.78: IC15.6 97.58,68.58
  Top 0.8: 97.58,68.58 98.42,69.12 D47.C | 96.93,79.22 L25.1
  Top 1.2: D47.C C61.2 97.4,74.96 96.46,76.25 96.93,79.22
N$45
  Top 0.8: 105.51,70.7 C62.2 | 104.96,77.95 L25.2
  Top 1.2: 105.51,70.7 106.61,70.53 107.14,69.8 106.48,65.66 101.98,62.39 C63.1 94.07,60.9 93.14,59.96 92.96,59.78 79.3,59.78 D48.A | C62.2 105.9,73.34 104.53,75.23 104.96,77.95
N$46  (via drill 0.35 pad 0.7)
  Top 0.3: 79.66,82.57 v79.3,82.21 | 74.44,64.64 v74.44,65.13
  Top 0.7: v79.73,82.91 v78.81,82.91 v79.3,82.21 v80.22,82.21 v80.65,82.91 v79.73,82.91 | v79.73,82.91 79.73,82.56 | v75.09,64.48 v74.44,65.13 v74.29,64.28 v74.94,63.63 v75.74,63.83 v75.09,64.48 | v75.09,64.48 74.84,64.23
  Top 0.8: D49.A
  Top 1.2: D49.A 79.66,82.57 | D48.C 74.44,64.64
  Bottom 0.3: 79.73,82.58 v79.73,82.91 | 74.94,64.14 v74.94,63.63
  Bottom 0.7: v79.73,82.91 v78.81,82.91 v79.3,82.21 v80.22,82.21 v80.65,82.91 v79.73,82.91 | v79.73,82.91 79.73,82.56 | v75.09,64.48 v74.44,65.13 v74.29,64.28 v74.94,63.63 v75.74,63.83 v75.09,64.48 | v75.09,64.48 74.84,64.23
  Bottom 1.2: 79.73,82.58 72.52,82.58 70.89,80.95 arc-33 69.36,71.88 70.08,69.01 74.94,64.14
N$47  (via drill 0.35 pad 0.7)
  Top 0.3: U1.7 | U1.7 v52.64,19.88
  Bottom 0.3: 52.64,19.21 C22.1
  Bottom 0.5: v52.64,19.88 52.64,19.21
N$48
  Top 0.3: IC2.4 22.42,12.36 22.79,11.98 22.79,11.68 23.09,11.38 23.75,11.38 R2.1
N$49
  Top 0.3: 19.89,11.99 IC2.6 19.89,11.49 20.19,11.18 22.29,11.18 22.59,10.88 22.59,9.38 22.99,8.98 23.77,8.98 R1.1
N$50  (via drill 0.35 pad 0.7)
  Top 0.7: v86.58,83.49 v87.29,83.06 v87.29,82.14 v86.58,81.65 | v86.58,82.57 v86.58,81.65 | v86.58,83.49 v86.58,82.57 | v86.58,82.57 86.94,82.57 | v87.56,66.85 v87.56,65.93 v88.27,66.42 v88.27,67.34 v87.56,67.77 v87.56,66.85 | v87.56,66.85 87.92,66.85 87.92,66.16 88.19,65.88 | v86.58,83.49 86.58,83.43 85.69,83.43 | v86.58,81.65 86.58,81.63 85.69,81.63 | v86.58,83.49 v86.58,83.48 85.54,83.48 | IC15.3 94.14,66.98
  Top 0.8: 90.78,64.16 R41.1 | 94.14,66.98 93.74,64.38 C63.2
  Top 1.2: C63.2 90.78,64.16 89.91,64.16 88.19,65.88 | D49.C 85.44,82.57 v86.58,82.57
  Bottom 0.7: v86.58,82.57 v86.58,81.65 v87.29,82.14 v87.29,83.06 v86.58,83.49 v86.58,82.57 | v86.58,82.57 86.94,82.57 | v87.56,66.85 v87.56,65.93 v88.27,66.42 v88.27,67.34 v87.56,67.77 v87.56,66.85 | v87.56,66.85 87.92,66.85
  Bottom 1.2: 86.94,82.57 87.94,81.56 87.94,66.87 87.92,66.85
N$51
  Top 0.5: IC16.1 51.61,119.52
  Top 0.8: 51.61,119.52 49.06,119.11 C65.1
  Top 1.2: C65.1 47.79,118.88 47.04,117.84 D51.C
N$52
  Top 1.2: D50.1 48.13,113.95 47.6,114.33 D51.A
N$53
  Top 0.78: IC16.6 51.32,122.74
  Top 0.8: 51.32,122.74 50.55,123.29 D52.C | 41.4,118.75 L26.1
  Top 1.2: D52.C C65.2 45.19,120.49 44.25,119.2 41.4,118.75
N$54  (via drill 0.35 pad 0.7)
  Top 0.3: 74.93,104.03 74.93,104.02 74.64,103.73 | D53.A 73.93,103.02 v74.39,103.48
  Top 0.7: v74.39,103.48 v75.04,102.83 v75.19,103.68 v74.54,104.33 v73.74,104.13 v74.39,103.48 | v74.39,103.48 74.64,103.73 | v64.14,114.98 v64.79,114.33 v64.94,115.18 v64.29,115.83 v63.49,115.63 v64.14,114.98 | v64.14,114.98 64.39,115.23
  Top 0.8: 46.86,129.54 C66.2 | 40.17,126.91 L26.2 | D53.A 73.92,103.02
  Top 1.2: 46.86,129.54 46.69,130.65 47.21,131.37 51.35,132.03 55.86,128.76 C67.1 58.94,122.53 63.14,118.33 63.14,116.48 64.39,115.23 | C66.2 44.23,129.1 42.96,127.36 40.17,126.91